# EAGLE design Backplane - Mark Copy (EAGLE 6.5.0)

## Sheet 1 of 4
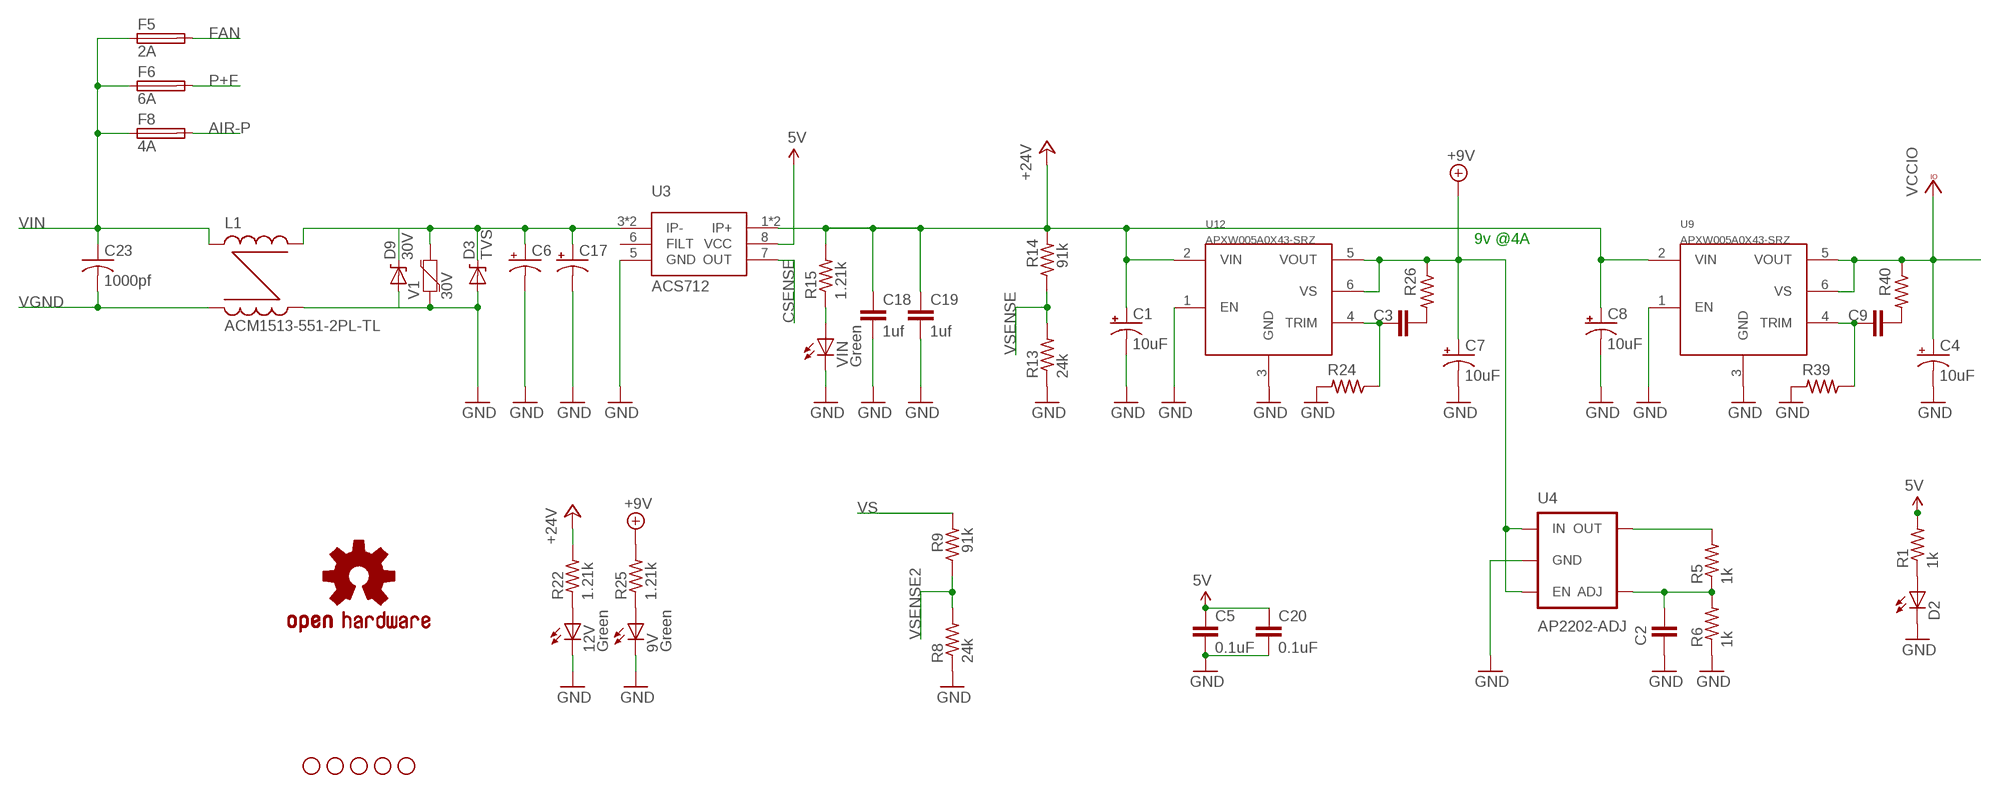
[diagram p0: schematic, sheet 1]

### Parts
9V  Green  LEDCHIP-LED0805  [CHIP-LED0805]
12V  Green  LEDCHIP-LED0805  [CHIP-LED0805]
C1  10uF  CAP_POL3528  [EIA3528]
C2  CAP0805  [0805]
C3  CAP0805  [0805]
C4  10uF  CAP_POL3528  [EIA3528]
C5  0.1uF  CAP0805  [0805]
C6  CPOL-USG  [PANASONIC_G]
C7  10uF  CAP_POL3528  [EIA3528]
C8  10uF  CAP_POL3528  [EIA3528]
C9  CAP0805  [0805]
C17  CPOL-USG  [PANASONIC_G]
C18  1uf  CAP1206  [1206]
C19  1uf  CAP1206  [1206]
C20  0.1uF  CAP0805  [0805]
C23  1000pf  C-USC1825  [C1825]
D2  LEDCHIP-LED0805  [CHIP-LED0805]
D3  TVS  [DO-214AC]
D9  30V  DIODE-ZENERSMB  [SMB-DIODE]
F5  2A  FUSEF456  [F456]
F6  6A  FUSEF456  [F456]
F8  4A  FUSEF456  [F456]
L1  ACM1513-551-2PL-TL  [ACM1513-551-2PL-TL]
R1  1k  R-US_R0805  [R0805]
R5  1k  R-US_R0805  [R0805]
R6  1k  R-US_R0805  [R0805]
R8  24k  R-US_R0805  [R0805]
R9  91k  R-US_R0805  [R0805]
R13  24k  R-US_R0805  [R0805]
R14  91k  R-US_R0805  [R0805]
R15  1.21k  R-US_R0805  [R0805]
R22  1.21k  R-US_R0805  [R0805]
R24  R-US_R0805  [R0805]
R25  1.21k  R-US_R0805  [R0805]
R26  R-US_R0805  [R0805]
R39  R-US_R0805  [R0805]
R40  R-US_R0805  [R0805]
STANDOFF1  STAND-OFF  [STAND-OFF]
STANDOFF2  STAND-OFF  [STAND-OFF]
STANDOFF3  STAND-OFF  [STAND-OFF]
STANDOFF4  STAND-OFF  [STAND-OFF]
STANDOFF5  STAND-OFF  [STAND-OFF]
U3  ACS712  [SO-8]
U4  AP2202-ADJ  [SOT23-5]
U9  APXW005A0X43-SRZ  [APXW005A0X43-SRZ]
U12  APXW005A0X43-SRZ  [APXW005A0X43-SRZ]
U$8  OSHW-LOGOM  [OSHW-LOGO-M]
V1  30V  VARISTOR-0603  [0603-RES]
VIN  Green  LEDCHIP-LED0805  [CHIP-LED0805]

### Nets
5V: C5.1 C20.1 R1.2 U3.8(VCC) ; also sheet 3
+9V: C7.A(+) R25.2 R26.1 U4.1(IN) U4.3(EN) U12.5(VOUT) U12.6(VS)
+24V: C1.A(+) C8.A(+) C18.1 C19.1 R14.2 R15.2 R22.2 U3.1(IP+) U3.2(IP+) U9.2(VIN) U12.2(VIN) ; also sheet 2,3,4
AIR-P: F8.2 ; also sheet 2
CSENSE: U3.7(OUT) ; also sheet 3
FAN: F5.2 ; also sheet 2
GND: 9V.C 12V.C C1.C(-) C2.2 C4.C(-) C5.2 C6.- C7.C(-) C8.C(-) C17.- C18.2 C19.2 C20.2 D2.C D3.A D9.A L1.OUT- R6.1 R8.1 R13.1 R24.2 R39.2 U3.5(GND) U4.2(GND) U9.1(EN) U9.3(GND) U12.1(EN) U12.3(GND) V1.1 VIN.C ; also sheet 2,3,4
N$3: C2.1 R5.1 R6.2 U4.4(ADJ)
N$4: R5.2 U4.5(OUT)
N$8: 9V.A R25.1
N$19: D2.A R1.1
N$29: 12V.A R22.1
N$30: C6.+ C17.+ D3.C D9.C L1.OUT+ U3.3(IP-) U3.4(IP-) V1.2
N$35: C3.1 R26.2
N$37: C3.2 R24.1 U12.4(TRIM)
N$42: R15.1 VIN.A
N$59: C9.1 R40.2
N$60: C9.2 R39.1 U9.4(TRIM)
P+F: F6.2 ; also sheet 2
VCCIO: C4.A(+) R40.1 U9.5(VOUT) U9.6(VS) ; also sheet 3
VGND: C23.2 L1.IN- ; also sheet 2
VIN: C23.1 F5.1 F6.1 F8.1 L1.IN+ ; also sheet 2
VS: R9.2
VSENSE: R13.2 R14.1 ; also sheet 3
VSENSE2: R8.2 R9.1
Unconnected: U3.6(FILT)

### Notes on the sheet
- 9v @4A

## Sheet 2 of 4
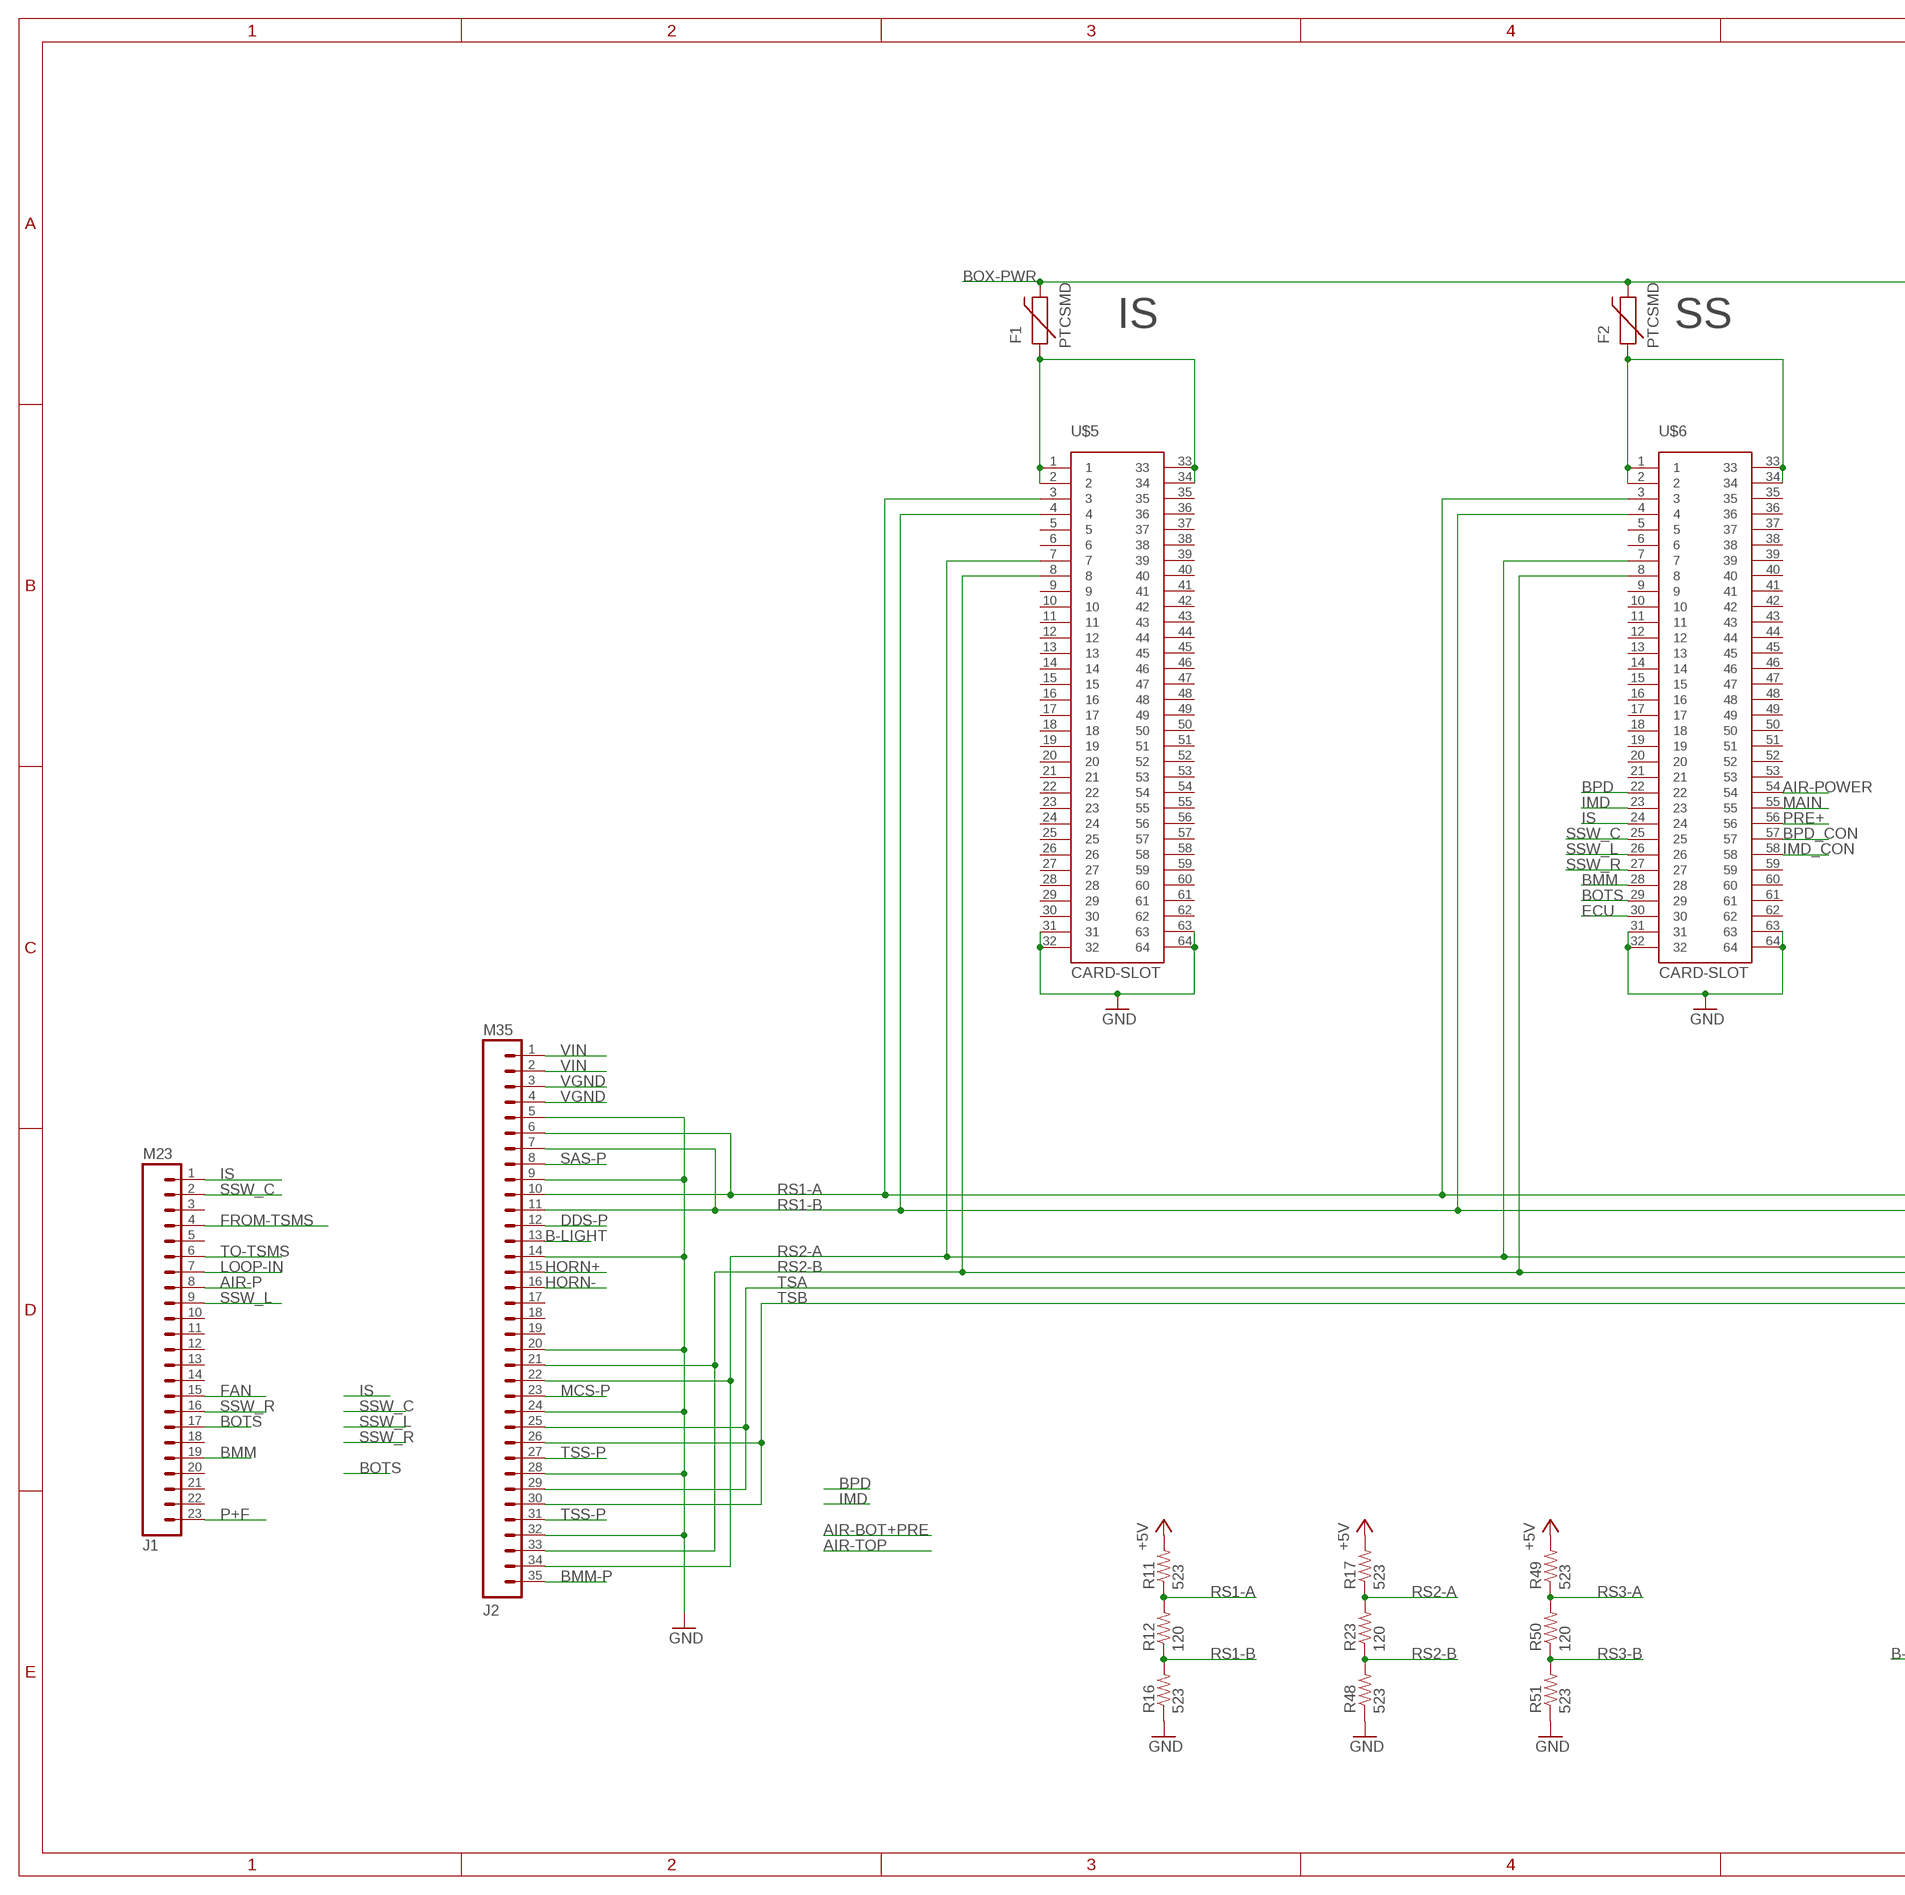
[diagram p1: schematic, sheet 2, part 1 of 2]
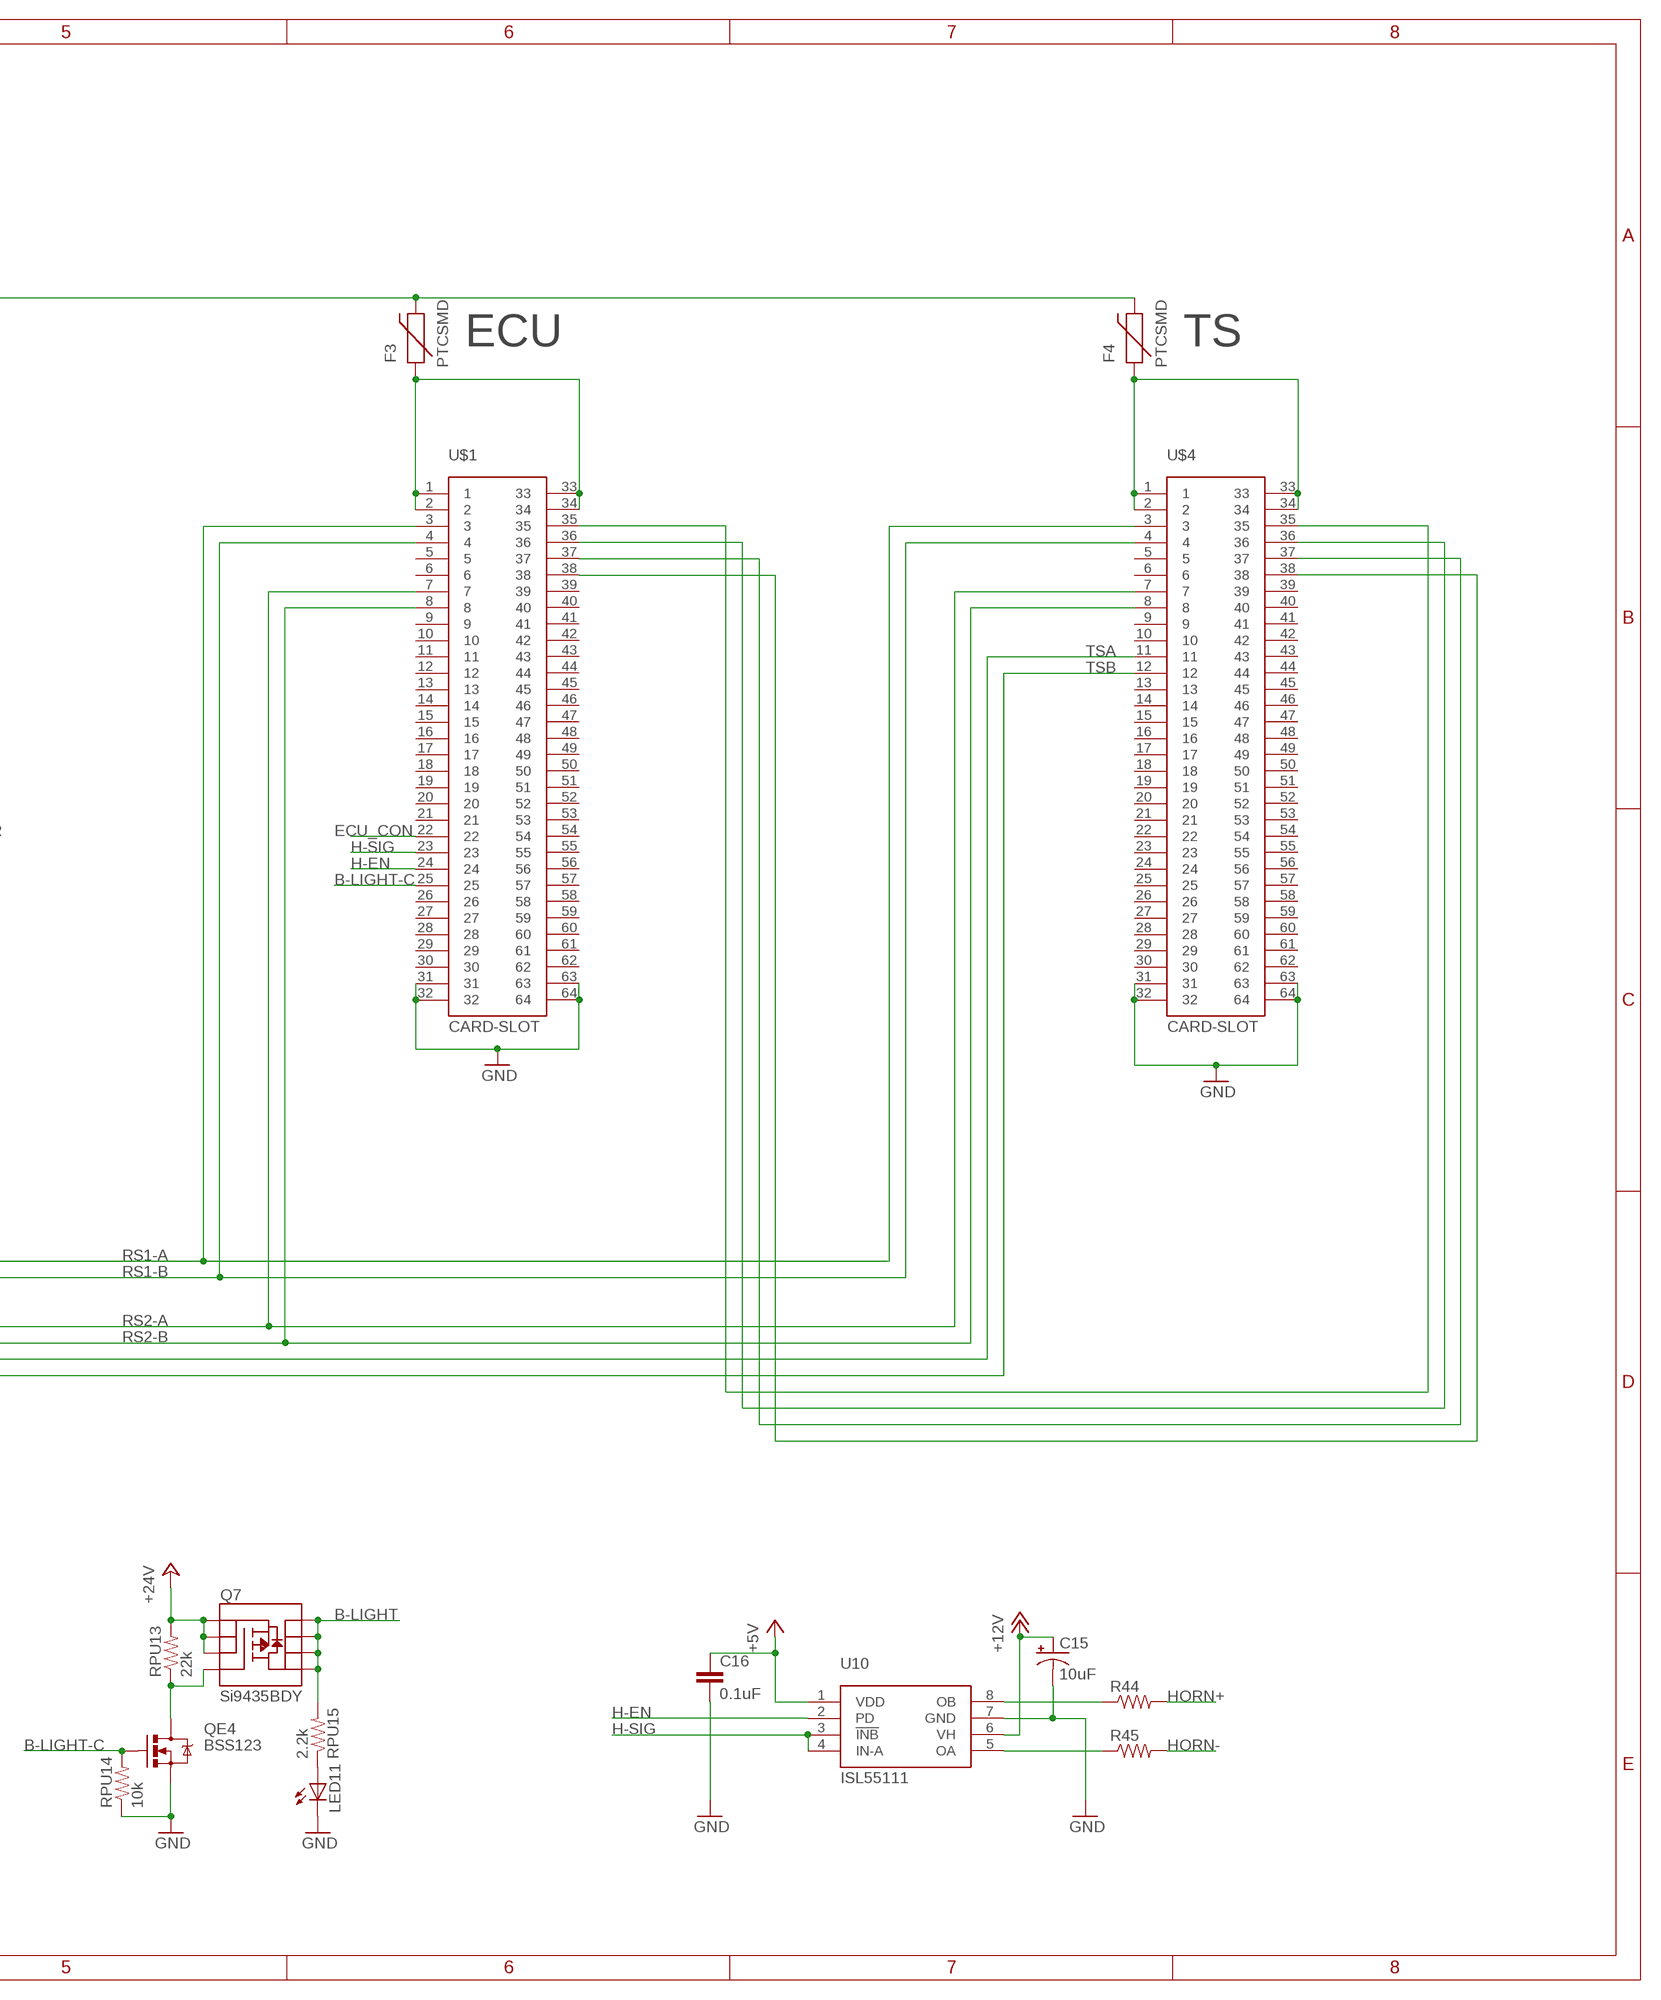
[diagram p2: schematic, sheet 2, part 2 of 2]

### Parts
C15  10uF  CAP_POL3528  [EIA3528]
C16  0.1uF  CAP0805  [0805]
F1  PTCSMD  [PTC-1206]
F2  PTCSMD  [PTC-1206]
F3  PTCSMD  [PTC-1206]
F4  PTCSMD  [PTC-1206]
J1  M23  [1-770669-1]
J2  M35  [1-776163-2]
LED11  LEDCHIP-LED0805  [CHIP-LED0805]
Q7  Si9435BDY  MOSFET-PCHANNEL-SOIC8SOIC8  [SO08]
QE4  BSS123  [SOT-23]
R11  523  RESISTOR0805-RES  [0805]
R12  120  RESISTOR0805-RES  [0805]
R16  523  RESISTOR0805-RES  [0805]
R17  523  RESISTOR0805-RES  [0805]
R23  120  RESISTOR0805-RES  [0805]
R44  RESISTOR0805-RES  [0805]
R45  RESISTOR0805-RES  [0805]
R48  523  RESISTOR0805-RES  [0805]
R49  523  RESISTOR0805-RES  [0805]
R50  120  RESISTOR0805-RES  [0805]
R51  523  RESISTOR0805-RES  [0805]
RPU13  22k  RESISTOR0805-RES  [0805]
RPU14  10k  RESISTOR0805-RES  [0805]
RPU15  2.2k  RESISTOR0805-RES  [0805]
U10  ISL55111  [TSSOP-8]
U$1  CARD-SLOT  [CS64]
U$4  CARD-SLOT  [CS64]
U$5  CARD-SLOT  [CS64]
U$6  CARD-SLOT  [CS64]

### Nets
+5V: C16.1 R11.2 R17.2 R49.2 U10.1(VDD) ; also sheet 3
+12V: C15.A(+) U10.6(VH)
+24V: Q7.1(S) Q7.2(S) Q7.3(S) RPU13.2 ; also sheet 1,3,4
AIR-P: J1.8 ; also sheet 1
AIR-POWER: U$6.54
B-LIGHT: J2.13 Q7.5(D) Q7.6(D) Q7.7(D) Q7.8(D) RPU15.2
B-LIGHT-C: QE4.1(G) RPU14.2 U$1.25
BMM: J1.19 U$6.28
BMM-P: J2.35 ; also sheet 3
BOTS: J1.17 U$6.29
BOX-PWR: F1.2 F2.2 F3.2 F4.2 ; also sheet 3
BPD: U$6.22 ; also sheet 4
BPD_CON: U$6.57
DDS-P: J2.12 ; also sheet 3
ECU: U$6.30 ; also sheet 4
ECU_CON: U$1.22
FAN: J1.15 ; also sheet 1
FROM-TSMS: J1.4 ; also sheet 4
GND: C15.C(-) C16.2 J2.5 J2.9 J2.14 J2.20 J2.24 J2.28 J2.32 LED11.C QE4.2(S) R16.1 R48.1 R51.1 RPU14.1 U10.7(GND) U$1.31 U$1.32 U$1.63 U$1.64 U$4.31 U$4.32 U$4.63 U$4.64 U$5.31 U$5.32 U$5.63 U$5.64 U$6.31 U$6.32 U$6.63 U$6.64 ; also sheet 1,3,4
H-EN: U10.2(PD) U$1.24
H-SIG: U10.3(!INB) U10.4(IN-A) U$1.23
HORN+: J2.15 R44.2
HORN-: J2.16 R45.2
IMD: U$6.23 ; also sheet 4
IMD_CON: U$6.58
IS: J1.1 U$6.24
LOOP-IN: J1.7 ; also sheet 4
MAIN: U$6.55 ; also sheet 4
MCS-P: J2.23 ; also sheet 3
N$5: F1.1 U$5.1 U$5.2 U$5.33 U$5.34
N$9: F2.1 U$6.1 U$6.2 U$6.33 U$6.34
N$12: F3.1 U$1.1 U$1.2 U$1.33 U$1.34
N$13: F4.1 U$4.1 U$4.2 U$4.33 U$4.34
N$32: Q7.4(G) QE4.3(D) RPU13.1
N$34: LED11.A RPU15.1
N$41: U$1.38 U$4.38
N$52: R44.1 U10.8(OB)
N$53: R45.1 U10.5(OA)
N$57: U$1.37 U$4.37
P+F: J1.23 ; also sheet 1
PRE+: U$6.56 ; also sheet 4
RS1-A: J2.6 J2.10 R11.1 R12.2 U$1.3 U$4.3 U$5.3 U$6.3
RS1-B: J2.7 J2.11 R12.1 R16.2 U$1.4 U$4.4 U$5.4 U$6.4
RS2-A: J2.22 J2.34 R17.1 R23.2 U$1.7 U$4.7 U$5.7 U$6.7 ; also sheet 3
RS2-B: J2.21 J2.33 R23.1 R48.2 U$1.8 U$4.8 U$5.8 U$6.8 ; also sheet 3
RS3-A: R49.1 R50.2 U$1.35 U$4.35
RS3-B: R50.1 R51.2 U$1.36 U$4.36
SAS-P: J2.8 ; also sheet 3
SSW_C: J1.2 U$6.25
SSW_L: J1.9 U$6.26
SSW_R: J1.16 U$6.27
TO-TSMS: J1.6 ; also sheet 4
TSA: J2.25 J2.29 U$4.11
TSB: J2.26 J2.30 U$4.12
TSS-P: J2.27 J2.31 ; also sheet 3
VGND: J2.3 J2.4 ; also sheet 1
VIN: J2.1 J2.2 ; also sheet 1
Unconnected: J1.3 J1.5 J1.10 J1.11 J1.12 J1.13 J1.14 J1.18 J1.20 J1.21 J1.22 J2.17 J2.18 J2.19 U$1.5 U$1.6 U$1.9 U$1.10 U$1.11 U$1.12 U$1.13 U$1.14 U$1.15 U$1.16 U$1.17 U$1.18 U$1.19 U$1.20 U$1.21 U$1.26 U$1.27 U$1.28 U$1.29 U$1.30 U$1.39 U$1.40 U$1.41 U$1.42 U$1.43 U$1.44 U$1.45 U$1.46 U$1.47 U$1.48 U$1.49 U$1.50 U$1.51 U$1.52 U$1.53 U$1.54 U$1.55 U$1.56 U$1.57 U$1.58 U$1.59 U$1.60 U$1.61 U$1.62 U$4.5 U$4.6 U$4.9 U$4.10 U$4.13 U$4.14 U$4.15 U$4.16 U$4.17 U$4.18 U$4.19 U$4.20 U$4.21 U$4.22 U$4.23 U$4.24 U$4.25 U$4.26 U$4.27 U$4.28 U$4.29 U$4.30 U$4.39 U$4.40 U$4.41 U$4.42 U$4.43 U$4.44 U$4.45 U$4.46 U$4.47 U$4.48 U$4.49 U$4.50 U$4.51 U$4.52 U$4.53 U$4.54 U$4.55 U$4.56 U$4.57 U$4.58 U$4.59 U$4.60 U$4.61 U$4.62 U$5.5 U$5.6 U$5.9 U$5.10 U$5.11 U$5.12 U$5.13 U$5.14 U$5.15 U$5.16 U$5.17 U$5.18 U$5.19 U$5.20 U$5.21 U$5.22 U$5.23 U$5.24 U$5.25 U$5.26 U$5.27 U$5.28 U$5.29 U$5.30 U$5.35 U$5.36 U$5.37 U$5.38 U$5.39 U$5.40 U$5.41 U$5.42 U$5.43 U$5.44 U$5.45 U$5.46 U$5.47 U$5.48 U$5.49 U$5.50 U$5.51 U$5.52 U$5.53 U$5.54 U$5.55 U$5.56 U$5.57 U$5.58 U$5.59 U$5.60 U$5.61 U$5.62 U$6.5 U$6.6 U$6.9 U$6.10 U$6.11 U$6.12 U$6.13 U$6.14 U$6.15 U$6.16 U$6.17 U$6.18 U$6.19 U$6.20 U$6.21 U$6.35 U$6.36 U$6.37 U$6.38 U$6.39 U$6.40 U$6.41 U$6.42 U$6.43 U$6.44 U$6.45 U$6.46 U$6.47 U$6.48 U$6.49 U$6.50 U$6.51 U$6.52 U$6.53 U$6.59 U$6.60 U$6.61 U$6.62

### Notes on the sheet
- IS | SS | ECU | TS

## Sheet 3 of 4
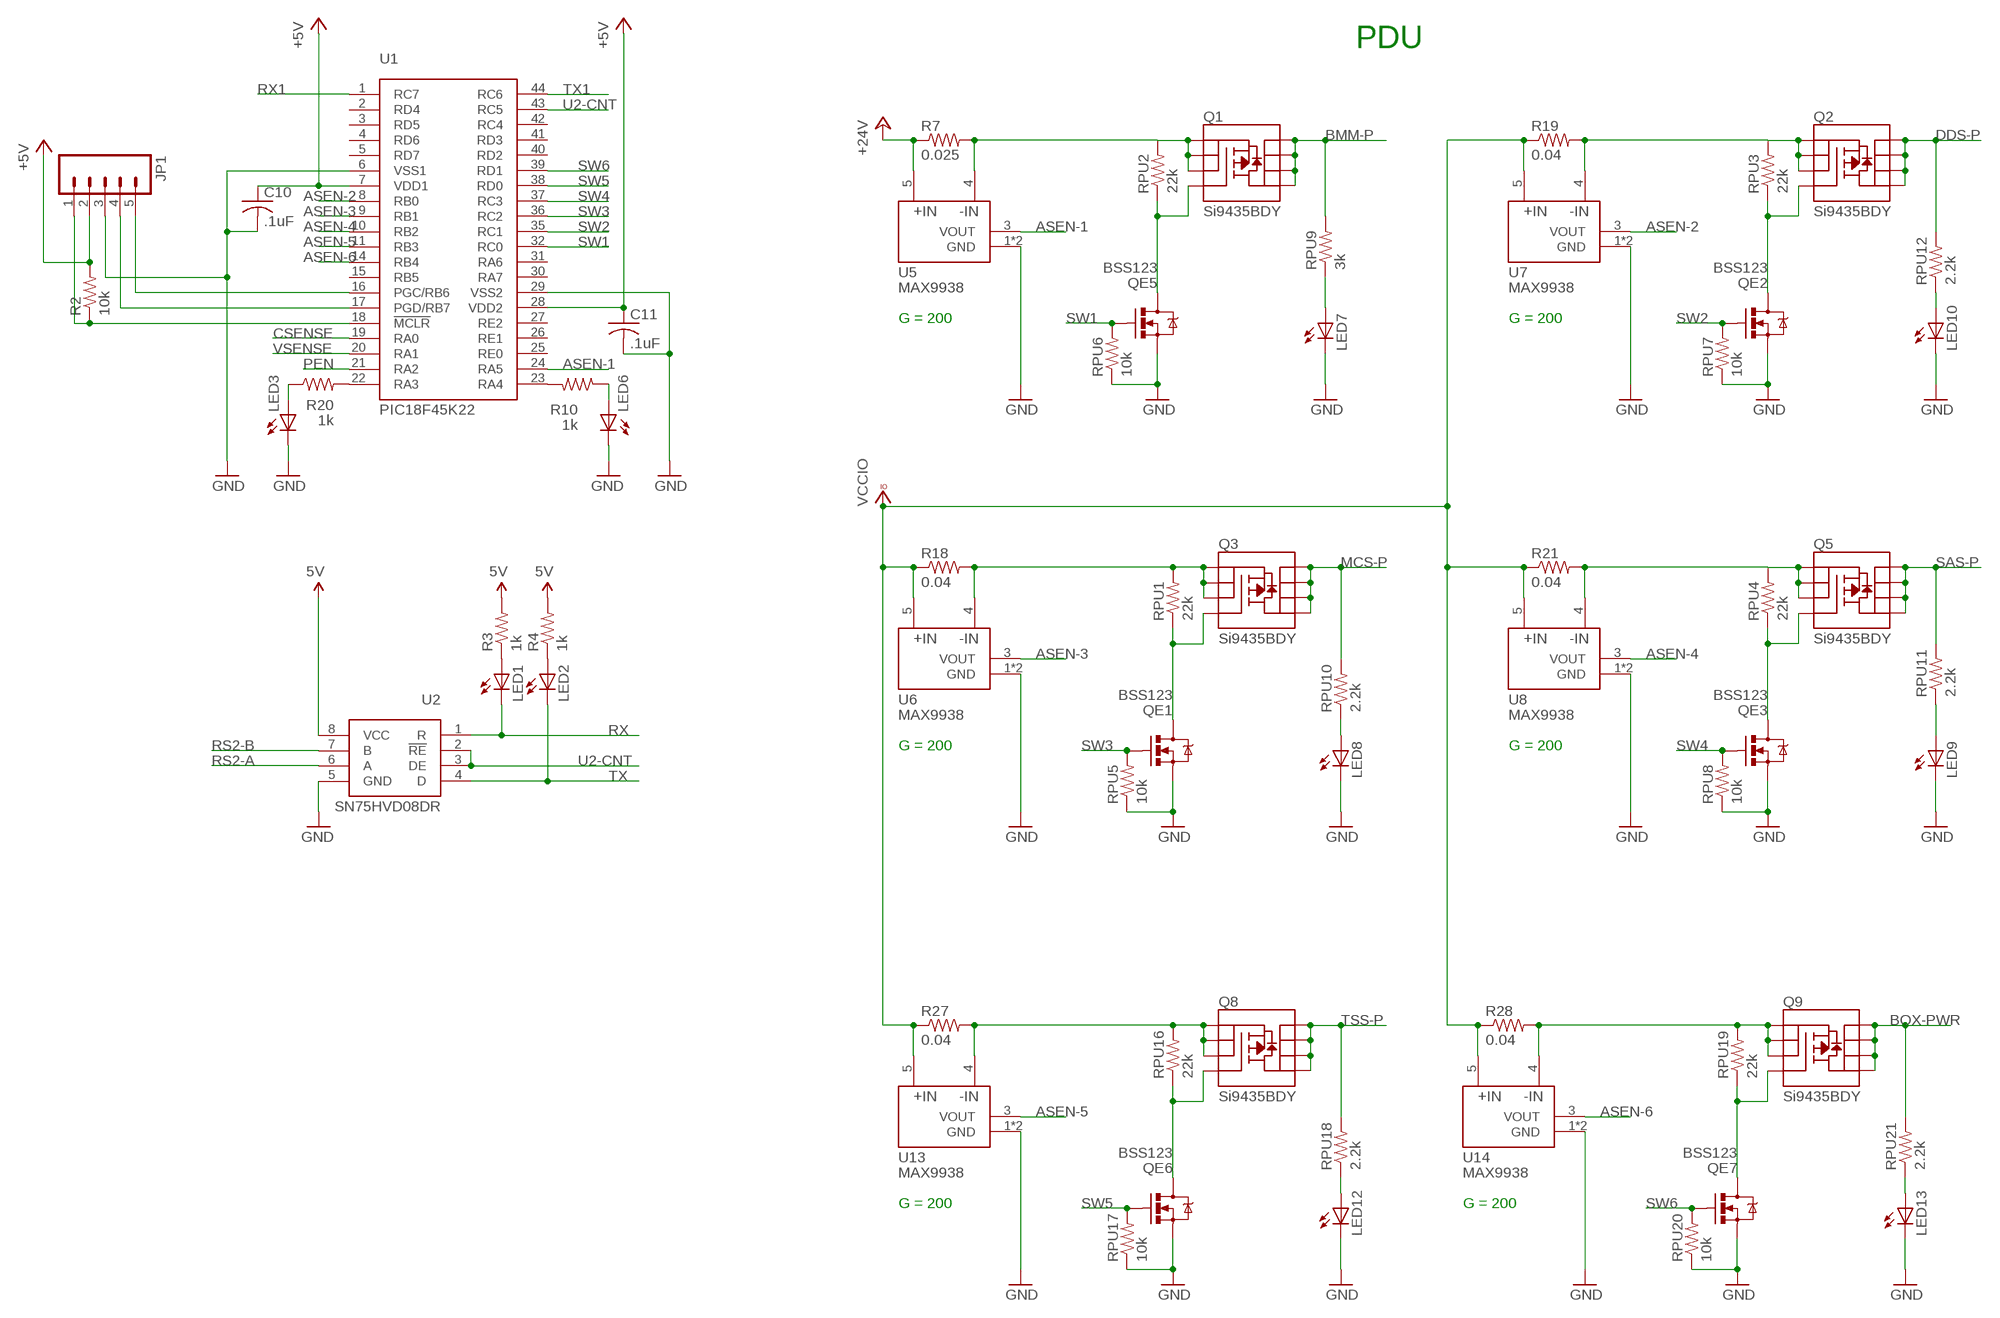
[diagram p3: schematic, sheet 3]

### Parts
C10  .1uF  C-USC0805  [C0805]
C11  .1uF  C-USC0805  [C0805]
JP1  M05LOCK_LONGPADS  [1X05_LOCK_LONGPADS]
LED1  LEDCHIP-LED0805  [CHIP-LED0805]
LED2  LEDCHIP-LED0805  [CHIP-LED0805]
LED3  LEDCHIP-LED0805  [CHIP-LED0805]
LED6  LEDCHIP-LED0805  [CHIP-LED0805]
LED7  LEDCHIP-LED0805  [CHIP-LED0805]
LED8  LEDCHIP-LED0805  [CHIP-LED0805]
LED9  LEDCHIP-LED0805  [CHIP-LED0805]
LED10  LEDCHIP-LED0805  [CHIP-LED0805]
LED12  LEDCHIP-LED0805  [CHIP-LED0805]
LED13  LEDCHIP-LED0805  [CHIP-LED0805]
Q1  Si9435BDY  MOSFET-PCHANNEL-SOIC8SOIC8  [SO08]
Q2  Si9435BDY  MOSFET-PCHANNEL-SOIC8SOIC8  [SO08]
Q3  Si9435BDY  MOSFET-PCHANNEL-SOIC8SOIC8  [SO08]
Q5  Si9435BDY  MOSFET-PCHANNEL-SOIC8SOIC8  [SO08]
Q8  Si9435BDY  MOSFET-PCHANNEL-SOIC8SOIC8  [SO08]
Q9  Si9435BDY  MOSFET-PCHANNEL-SOIC8SOIC8  [SO08]
QE1  BSS123  [SOT-23]
QE2  BSS123  [SOT-23]
QE3  BSS123  [SOT-23]
QE5  BSS123  [SOT-23]
QE6  BSS123  [SOT-23]
QE7  BSS123  [SOT-23]
R2  10k  RESISTOR0805-RES  [0805]
R3  1k  R-US_R0805  [R0805]
R4  1k  R-US_R0805  [R0805]
R7  0.025  R-US_R6332  [R6332]
R10  1k  R-US_R0805  [R0805]
R18  0.04  R-US_R6332  [R6332]
R19  0.04  R-US_R6332  [R6332]
R20  1k  R-US_R0805  [R0805]
R21  0.04  R-US_R6332  [R6332]
R27  0.04  R-US_R6332  [R6332]
R28  0.04  R-US_R6332  [R6332]
RPU1  22k  RESISTOR0805-RES  [0805]
RPU2  22k  RESISTOR0805-RES  [0805]
RPU3  22k  RESISTOR0805-RES  [0805]
RPU4  22k  RESISTOR0805-RES  [0805]
RPU5  10k  RESISTOR0805-RES  [0805]
RPU6  10k  RESISTOR0805-RES  [0805]
RPU7  10k  RESISTOR0805-RES  [0805]
RPU8  10k  RESISTOR0805-RES  [0805]
RPU9  3k  RESISTOR0805-RES  [0805]
RPU10  2.2k  RESISTOR0805-RES  [0805]
RPU11  2.2k  RESISTOR0805-RES  [0805]
RPU12  2.2k  RESISTOR0805-RES  [0805]
RPU16  22k  RESISTOR0805-RES  [0805]
RPU17  10k  RESISTOR0805-RES  [0805]
RPU18  2.2k  RESISTOR0805-RES  [0805]
RPU19  22k  RESISTOR0805-RES  [0805]
RPU20  10k  RESISTOR0805-RES  [0805]
RPU21  2.2k  RESISTOR0805-RES  [0805]
U1  PIC18F45K22  [TQFP-44]
U2  SN75HVD08DR  [SO-8]
U5  MAX9938  [SOT23-5]
U6  MAX9938  [SOT23-5]
U7  MAX9938  [SOT23-5]
U8  MAX9938  [SOT23-5]
U13  MAX9938  [SOT23-5]
U14  MAX9938  [SOT23-5]

### Nets
5V: R3.2 R4.2 U2.8(VCC) ; also sheet 1
+5V: C10.1 C11.1 JP1.2 R2.2 U1.7(VDD1) U1.28(VDD2) ; also sheet 2
+24V: R7.1 U5.5(+IN) ; also sheet 1,2,4
ASEN-1: U1.24(RA5) U5.3(VOUT)
ASEN-2: U1.8(RB0) U7.3(VOUT)
ASEN-3: U1.9(RB1) U6.3(VOUT)
ASEN-4: U1.10(RB2) U8.3(VOUT)
ASEN-5: U1.11(RB3) U13.3(VOUT)
ASEN-6: U1.14(RB4) U14.3(VOUT)
BMM-P: Q1.5(D) Q1.6(D) Q1.7(D) Q1.8(D) RPU9.2 ; also sheet 2
BOX-PWR: Q9.5(D) Q9.6(D) Q9.7(D) Q9.8(D) RPU21.2 ; also sheet 2
CSENSE: U1.19(RA0) ; also sheet 1
DDS-P: Q2.5(D) Q2.6(D) Q2.7(D) Q2.8(D) RPU12.2 ; also sheet 2
GND: C10.2 C11.2 JP1.3 LED3.C LED6.C LED7.C LED8.C LED9.C LED10.C LED12.C LED13.C QE1.2(S) QE2.2(S) QE3.2(S) QE5.2(S) QE6.2(S) QE7.2(S) RPU5.1 RPU6.1 RPU7.1 RPU8.1 RPU17.1 RPU20.1 U1.6(VSS1) U1.29(VSS2) U2.5(GND) U5.1(GND) U5.2(GND) U6.1(GND) U6.2(GND) U7.1(GND) U7.2(GND) U8.1(GND) U8.2(GND) U13.1(GND) U13.2(GND) U14.1(GND) U14.2(GND) ; also sheet 1,2,4
MCS-P: Q3.5(D) Q3.6(D) Q3.7(D) Q3.8(D) RPU10.2 ; also sheet 2
N$1: Q1.4(G) QE5.3(D) RPU2.1
N$2: Q8.1(S) Q8.2(S) Q8.3(S) R27.2 RPU16.2 U13.4(-IN)
N$10: Q3.1(S) Q3.2(S) Q3.3(S) R18.2 RPU1.2 U6.4(-IN)
N$11: Q3.4(G) QE1.3(D) RPU1.1
N$14: Q2.1(S) Q2.2(S) Q2.3(S) R19.2 RPU3.2 U7.4(-IN)
N$16: LED3.A R20.1
N$17: LED7.A RPU9.1
N$18: Q2.4(G) QE2.3(D) RPU3.1
N$20: R20.2 U1.22(RA3)
N$21: LED8.A RPU10.1
N$22: LED9.A RPU11.1
N$24: LED1.A R3.1
N$25: LED2.A R4.1
N$26: Q5.1(S) Q5.2(S) Q5.3(S) R21.2 RPU4.2 U8.4(-IN)
N$27: Q5.4(G) QE3.3(D) RPU4.1
N$28: LED10.A RPU12.1
N$31: Q8.4(G) QE6.3(D) RPU16.1
N$33: Q1.1(S) Q1.2(S) Q1.3(S) R7.2 RPU2.2 U5.4(-IN)
N$36: LED12.A RPU18.1
N$38: Q9.1(S) Q9.2(S) Q9.3(S) R28.2 RPU19.2 U14.4(-IN)
N$39: Q9.4(G) QE7.3(D) RPU19.1
N$40: JP1.4 U1.17(PGD/RB7)
N$43: JP1.5 U1.16(PGC/RB6)
N$44: LED13.A RPU21.1
N$46: JP1.1 R2.1 U1.18(!MCLR)
N$54: LED6.A R10.1
N$56: R10.2 U1.23(RA4)
PEN: U1.21(RA2)
RS2-A: U2.6(A) ; also sheet 2
RS2-B: U2.7(B) ; also sheet 2
RX: LED1.C U2.1(R)
RX1: U1.1(RC7)
SAS-P: Q5.5(D) Q5.6(D) Q5.7(D) Q5.8(D) RPU11.2 ; also sheet 2
SW1: QE5.1(G) RPU6.2 U1.32(RC0)
SW2: QE2.1(G) RPU7.2 U1.35(RC1)
SW3: QE1.1(G) RPU5.2 U1.36(RC2)
SW4: QE3.1(G) RPU8.2 U1.37(RC3)
SW5: QE6.1(G) RPU17.2 U1.38(RD0)
SW6: QE7.1(G) RPU20.2 U1.39(RD1)
TSS-P: Q8.5(D) Q8.6(D) Q8.7(D) Q8.8(D) RPU18.2 ; also sheet 2
TX: LED2.C U2.4(D)
TX1: U1.44(RC6)
U2-CNT: U1.43(RC5) U2.2(!RE) U2.3(DE)
VCCIO: R18.1 R19.1 R21.1 R27.1 R28.1 U6.5(+IN) U7.5(+IN) U8.5(+IN) U13.5(+IN) U14.5(+IN) ; also sheet 1
VSENSE: U1.20(RA1) ; also sheet 1
Unconnected: U1.2(RD4) U1.3(RD5) U1.4(RD6) U1.5(RD7) U1.15(RB5) U1.25(RE0) U1.26(RE1) U1.27(RE2) U1.30(RA7) U1.31(RA6) U1.40(RD2) U1.41(RD3) U1.42(RC4)

### Notes on the sheet
- PDU
- G = 200 | G = 200
- G = 200 | G = 200
- G = 200 | G = 200

## Sheet 4 of 4
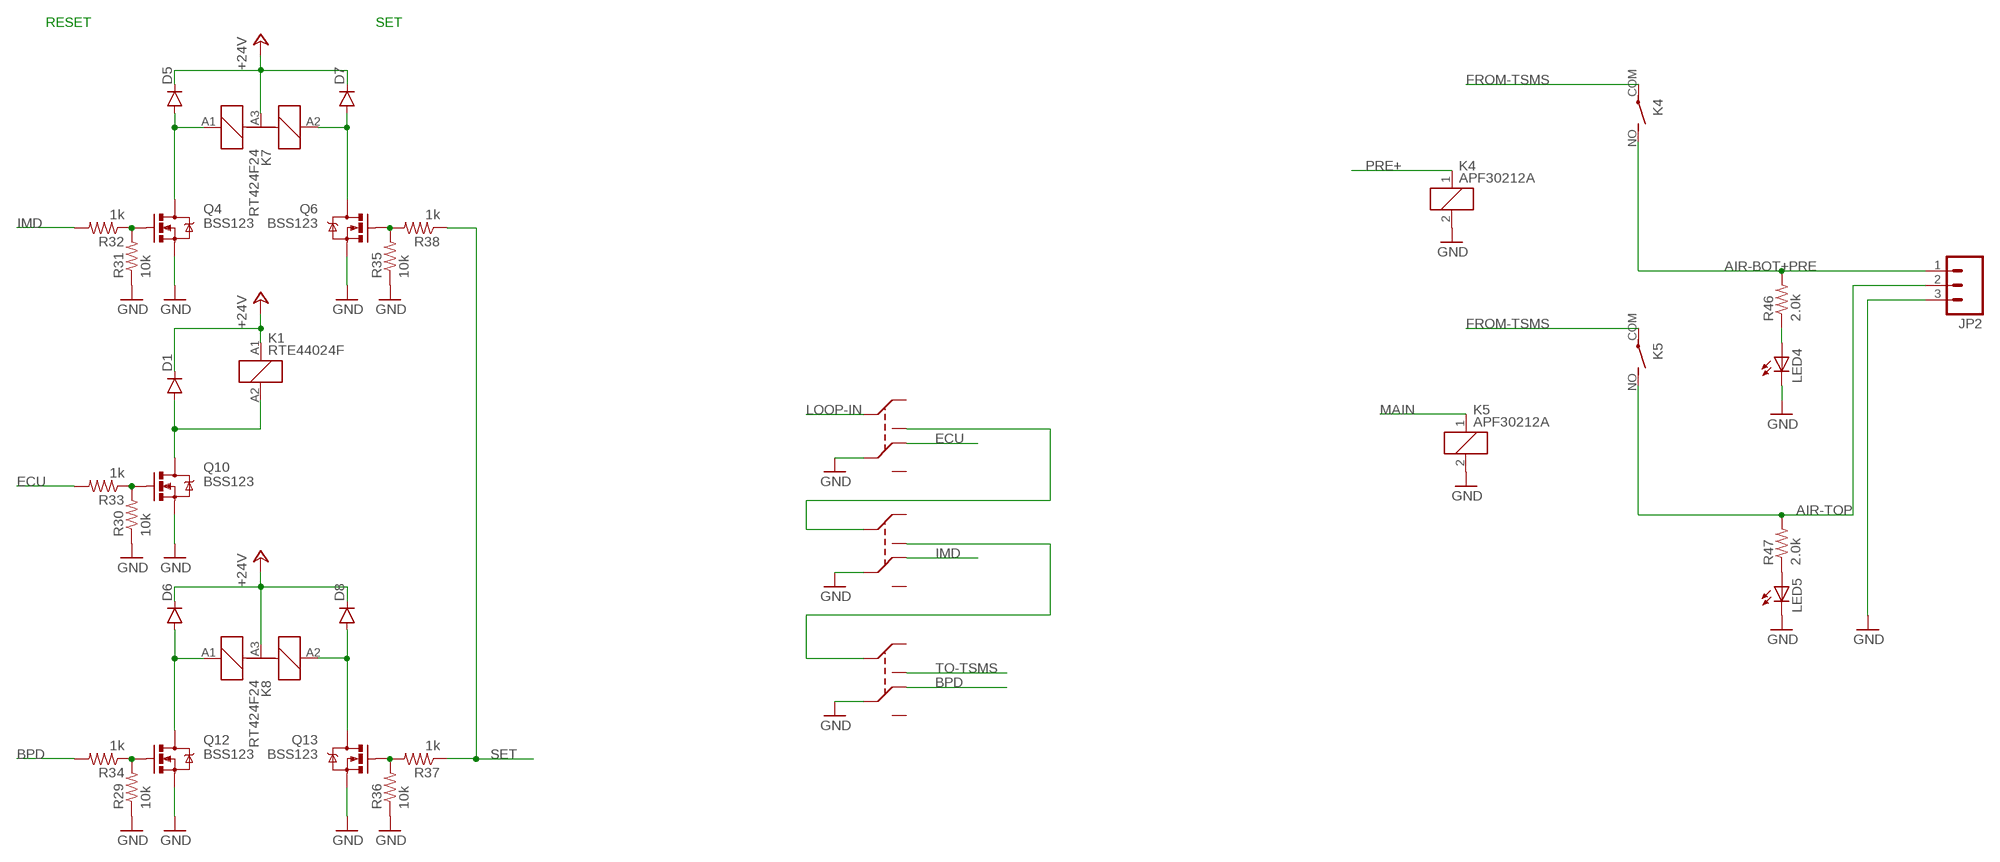
[diagram p4: schematic, sheet 4]

### Parts
D1  DIODESMA-KIT  [SMA-DIODE-KIT]
D5  DIODESMA-KIT  [SMA-DIODE-KIT]
D6  DIODESMA-KIT  [SMA-DIODE-KIT]
D7  DIODESMA-KIT  [SMA-DIODE-KIT]
D8  DIODESMA-KIT  [SMA-DIODE-KIT]
JP2  M03POLAR_LOCK  [MOLEX-1X3_LOCK]
K1  RTE44024F  [RTE44024F]
K4  APF30212A  [APF30212A]
K5  APF30212A  [APF30212A]
K7  RT424F24  [RT424F24]
K8  RT424F24  [RT424F24]
LED4  LEDCHIPLED_0805  [CHIPLED_0805]
LED5  LEDCHIPLED_0805  [CHIPLED_0805]
Q4  BSS123  MOSFET-NCHANNELBSS123LT1G  [SOT23-3]
Q6  BSS123  MOSFET-NCHANNELBSS123LT1G  [SOT23-3]
Q10  BSS123  MOSFET-NCHANNELBSS123LT1G  [SOT23-3]
Q12  BSS123  MOSFET-NCHANNELBSS123LT1G  [SOT23-3]
Q13  BSS123  MOSFET-NCHANNELBSS123LT1G  [SOT23-3]
R29  10k  RESISTOR0805-RES  [0805]
R30  10k  RESISTOR0805-RES  [0805]
R31  10k  RESISTOR0805-RES  [0805]
R32  1k  RESISTOR0805-RES  [0805]
R33  1k  RESISTOR0805-RES  [0805]
R34  1k  RESISTOR0805-RES  [0805]
R35  10k  RESISTOR0805-RES  [0805]
R36  10k  RESISTOR0805-RES  [0805]
R37  1k  RESISTOR0805-RES  [0805]
R38  1k  RESISTOR0805-RES  [0805]
R46  2.0k  RESISTOR0805-RES  [0805]
R47  2.0k  RESISTOR0805-RES  [0805]

### Nets
+24V: D1.C D5.C D6.C D7.C D8.C K1.A1(+) K7.A3(-) K8.A3(-) ; also sheet 1,2,3
AIR-BOT+PRE: JP2.1 K4.NO(2:S) R46.2 ; also sheet 2
AIR-TOP: JP2.2 K5.NO(2:S) R47.2 ; also sheet 2
BPD: R34.2 ; also sheet 2
ECU: K1.22(NC2) R33.2 ; also sheet 2
FROM-TSMS: K4.COM(2:P) K5.COM(2:P) ; also sheet 2
GND: JP2.3 K1.21(C2) K4.2 K5.2 K7.21(C2) K8.21(C2) LED4.C LED5.C Q4.2(S) Q6.2(S) Q10.2(S) Q12.2(S) Q13.2(S) R29.1 R30.1 R31.1 R35.1 R36.1 ; also sheet 1,2,3
IMD: K7.22(NC2) R32.2 ; also sheet 2
LOOP-IN: K1.11(C1) ; also sheet 2
MAIN: K5.1 ; also sheet 2
N$6: Q4.1(G) R31.2 R32.1
N$7: K1.14(NO1) K7.11(C1)
N$15: K7.14(NO1) K8.11(C1)
N$23: Q6.1(G) R35.2 R38.2
N$45: D1.A K1.A2(-) Q10.3(D)
N$47: D5.A K7.A1(+1) Q4.3(D)
N$48: Q10.1(G) R30.2 R33.1
N$49: D7.A K7.A2(+2) Q6.3(D)
N$50: D6.A K8.A1(+1) Q12.3(D)
N$51: D8.A K8.A2(+2) Q13.3(D)
N$55: Q13.1(G) R36.2 R37.2
N$58: Q12.1(G) R29.2 R34.1
N$71: LED4.A R46.1
N$72: LED5.A R47.1
PRE+: K4.1 ; also sheet 2
SET: R37.1 R38.1
TO-TSMS: K8.14(NO1) ; also sheet 2
Unconnected: K1.12(NC1) K1.24(NO2) K7.12(NC1) K7.24(NO2) K8.12(NC1) K8.22(NC2) K8.24(NO2)

### Notes on the sheet
- RESET | SET

## Library data of the parts
9V 12V D2 LED1-LED13 VIN = adafruit:LED: LED OSRAM: - CHIPLED LG R971, LG N971, LY N971, LG Q971, LY Q971, LO R971, LY R971 LH N974, LH R974 LS Q976, LO Q976, LY Q976 LO Q996 - Hyper CHIPLED LW Q18S LB Q993, LB Q99A, LB R99A - SideLED LS A670, LO A670, LY A670, LG A670, LP A670 LB A673, LV A673, LT A673, LW A673 LH A674 LY A675 LS A676, LA A676, LO A676, LY A676, LW A676 LS A679, LY A679, LG A679 - Hyper Micro SIDELED® LS Y876, LA Y876, LO Y876, LY Y876 LT Y87S - SmartLED LW L88C, LW L88S LB L89C, LB L89S, LG L890 LS L89K, LO L89K, LY L89K LS L896, LA L896, LO L896, LY L896 - TOPLED LS T670, LO T670, LY T670, LG T670, LP T670 LSG T670, LSP T670, LSY T670, LOP T670, LYG T670 LG T671, LOG T671, LSG T671 LB T673, LV T673, LT T673, LW T673 LH T674 LS T676, LA T676, LO T676, LY T676, LB T676, LH T676, LSB T676, LW T676 LB T67C, LV T67C, LT T67C, LS T67K, LO T67K, LY T67K, LW E67C LS E67B, LA E67B, LO E67B, LY E67B, LB E67C, LV E67C, LT E67C LW T67C LS T679, LY T679, LG T679 LS T770, LO T770, LY T770, LG T770, LP T770 LB T773, LV T773, LT T773, LW T773 LH T774 LS E675, LA E675, LY E675, LS T675 LS T776, LA T776, LO T776, LY T776, LB T776 LHGB T686 LT T68C, LB T68C - Hyper Mini TOPLED® LB M676 - Mini TOPLED Santana® LG M470 LS M47K, LO M47K, LY M47K Source: http://www.osram.convergy.de/
C1 C4 C7 C8 C15 = SparkFun-Passives:CAP_POL: Capacitor Polarized These are standard SMD and PTH capacitors. Normally 10uF, 47uF, and 100uF in electrolytic and tantalum varieties. Always verify the external diameter of the through hole cap, it varies with capacity, voltage, and manufacturer. The EIA devices should be standard.
C2 C3 C9 = SparkFun-Capacitors:CAP: Capacitor Standard 0603 ceramic capacitor, and 0.1" leaded capacitor.
C5 C16 C18-C20 = SparkFun-Passives:CAP: Capacitor Standard 0603 ceramic capacitor, and 0.1" leaded capacitor.
C6 C17 = adafruit:CPOL-US: POLARIZED CAPACITOR, American symbol
C10 C11 C23 = adafruit:C-US: CAPACITOR, American symbol
D1 D5-D8 = SparkFun-DiscreteSemi:DIODE: Diode These are standard reverse protection diodes and small signal diodes. SMA package can handle up to about 1A. SOD-323 can handle about 200mA. What the SOD-323 package when ordering, there are some mfgs out there that are 5-pin packages.
D3 = NASA_LIB:TVS
D9 = SparkFun:DIODE-ZENER: Zener Diode Production Part - 8199 3.4V Zener Voltage
F1-F4 = SparkFun-PowerIC:PTC: Resettable Fuse PTC Resettable Fuse. Spark Fun Electronics SKU : COM-08357; PROD_ID: RES-11150
F5 F6 F8 = fuse:FUSE: Fuse; OC_FARNELL: unknown; OC_NEWARK: unknown
J1 = FSAE Eletric:M23
J2 = FSAE Eletric:M35
JP1 = SparkFun-Connectors:M05: Header 5 Standard 5-pin 0.1" header. Use with straight break away headers (SKU : PRT-00116), right angle break away headers (PRT-00553), swiss pins (PRT-00743), machine pins (PRT-00117), and female headers (PRT-00115). Molex polarized connector foot print use with SKU : PRT-08230 with associated crimp pins and housings.
JP2 = SparkFun-Connectors:M03: Header 3 Standard 3-pin 0.1" header. Use with straight break away headers (SKU : PRT-00116), right angle break away headers (PRT-00553), swiss pins (PRT-00743), machine pins (PRT-00117), and female headers (PRT-00115). Molex polarized connector foot print use with SKU : PRT-08232 with associated crimp pins and housings.
K1 = FSAE Eletric:RTE44024F
K4 K5 = relay:APF30212A: Compliant with European standards 1a/1c 6A Slim power relays Source: Data sheet <http://pewa.panasonic.com/assets/pcsd/catalog/pf-catalog.pdf>; OC_FARNELL: unknown
K7 K8 = FSAE Eletric:RT424F24
L1 = FSAE Eletric:ACM1513-551-2PL-TL
Q1-Q3 Q5 Q7-Q9 = SparkFun-DiscreteSemi:MOSFET-PCHANNEL-SOIC8: Generic 8-pin PMOSFET
Q4 Q6 Q10 Q12 Q13 = SparkFun-DiscreteSemi:MOSFET-NCHANNEL: Common NMOSFET Parts MFG P/N Store ID Prod ID FDD8780 TRANS-09984 SI7820DN TRANS-11055 FDS6630A IC-08089 2N7002PW TRANS-11151 FQP30N06L COM-10213 TRANS-10060 BSS123LT1G TRANS-08345 BSS138 TRANS-00830 BS170 2N7000; PROD_ID: TRANS-08345
QE1-QE7 = DFT:BSS123
R1 R3-R10 R13-R15 R18-R22 R24-R28 R39 R40 = adafruit:R-US_: RESISTOR, American symbol
R2 R11 R12 R16 R17 R23 R29-R38 R44-R51 = SparkFun-Passives:RESISTOR: Resistor Basic schematic elements and footprints for 0603, 1206, and PTH resistors.
RPU1-RPU21 = SparkFun:RESISTOR: Resistor Basic schematic elements and footprints for 0603, 1206, and PTH resistors.
STANDOFF1-STANDOFF5 = SparkFun-Electromechanical:STAND-OFF: #4 Stand Off This is the mechanical footprint for a #4 phillips button head screw. Use the keepout ring to avoid running the screw head into surrounding components. SKU : PRT-00447
U1 = FSAE Eletric:PIC18F45K22
U2 = FSAE Eletric:SN75HVD08DR
U3 = FSAE Eletric:ACS712
U4 = SparkFun-PowerIC:AP2202-ADJ: AP2202 Adjustable LDO Diodes Inc small, low-cost LDO 150mA, 13.2V, less than 200mV dropout; PROD_ID: VREG-12189
U5-U8 U13 U14 = FSAE Eletric:MAX9938
U9 U12 = NASA_LIB:APXW005A0X43-SRZ
U10 = FSAE Eletric:ISL55111
U$1 U$4-U$6 = FSAE Eletric:CARD-SLOT
U$8 = SparkFun:OSHW-LOGO: Open Source Hardware Logo This logo indicates the piece of hardware it is found on incorporates a OSHW license and/or adheres to the definition of open source hardware found here: http://freedomdefined.org/OSHW
V1 = SparkFun:VARISTOR: Varistor Varistor (Variable resistor) is a nonlinear resistive element of the voltage dependence that resistance changes with applied voltage. Varistor is equivalent with Zener diode of two series connection.

## Net classes
0 default: clearance 0.355 mm
1 power: width 0.61 mm, drill 0.711 mm, clearance 0.203 mm

## Board
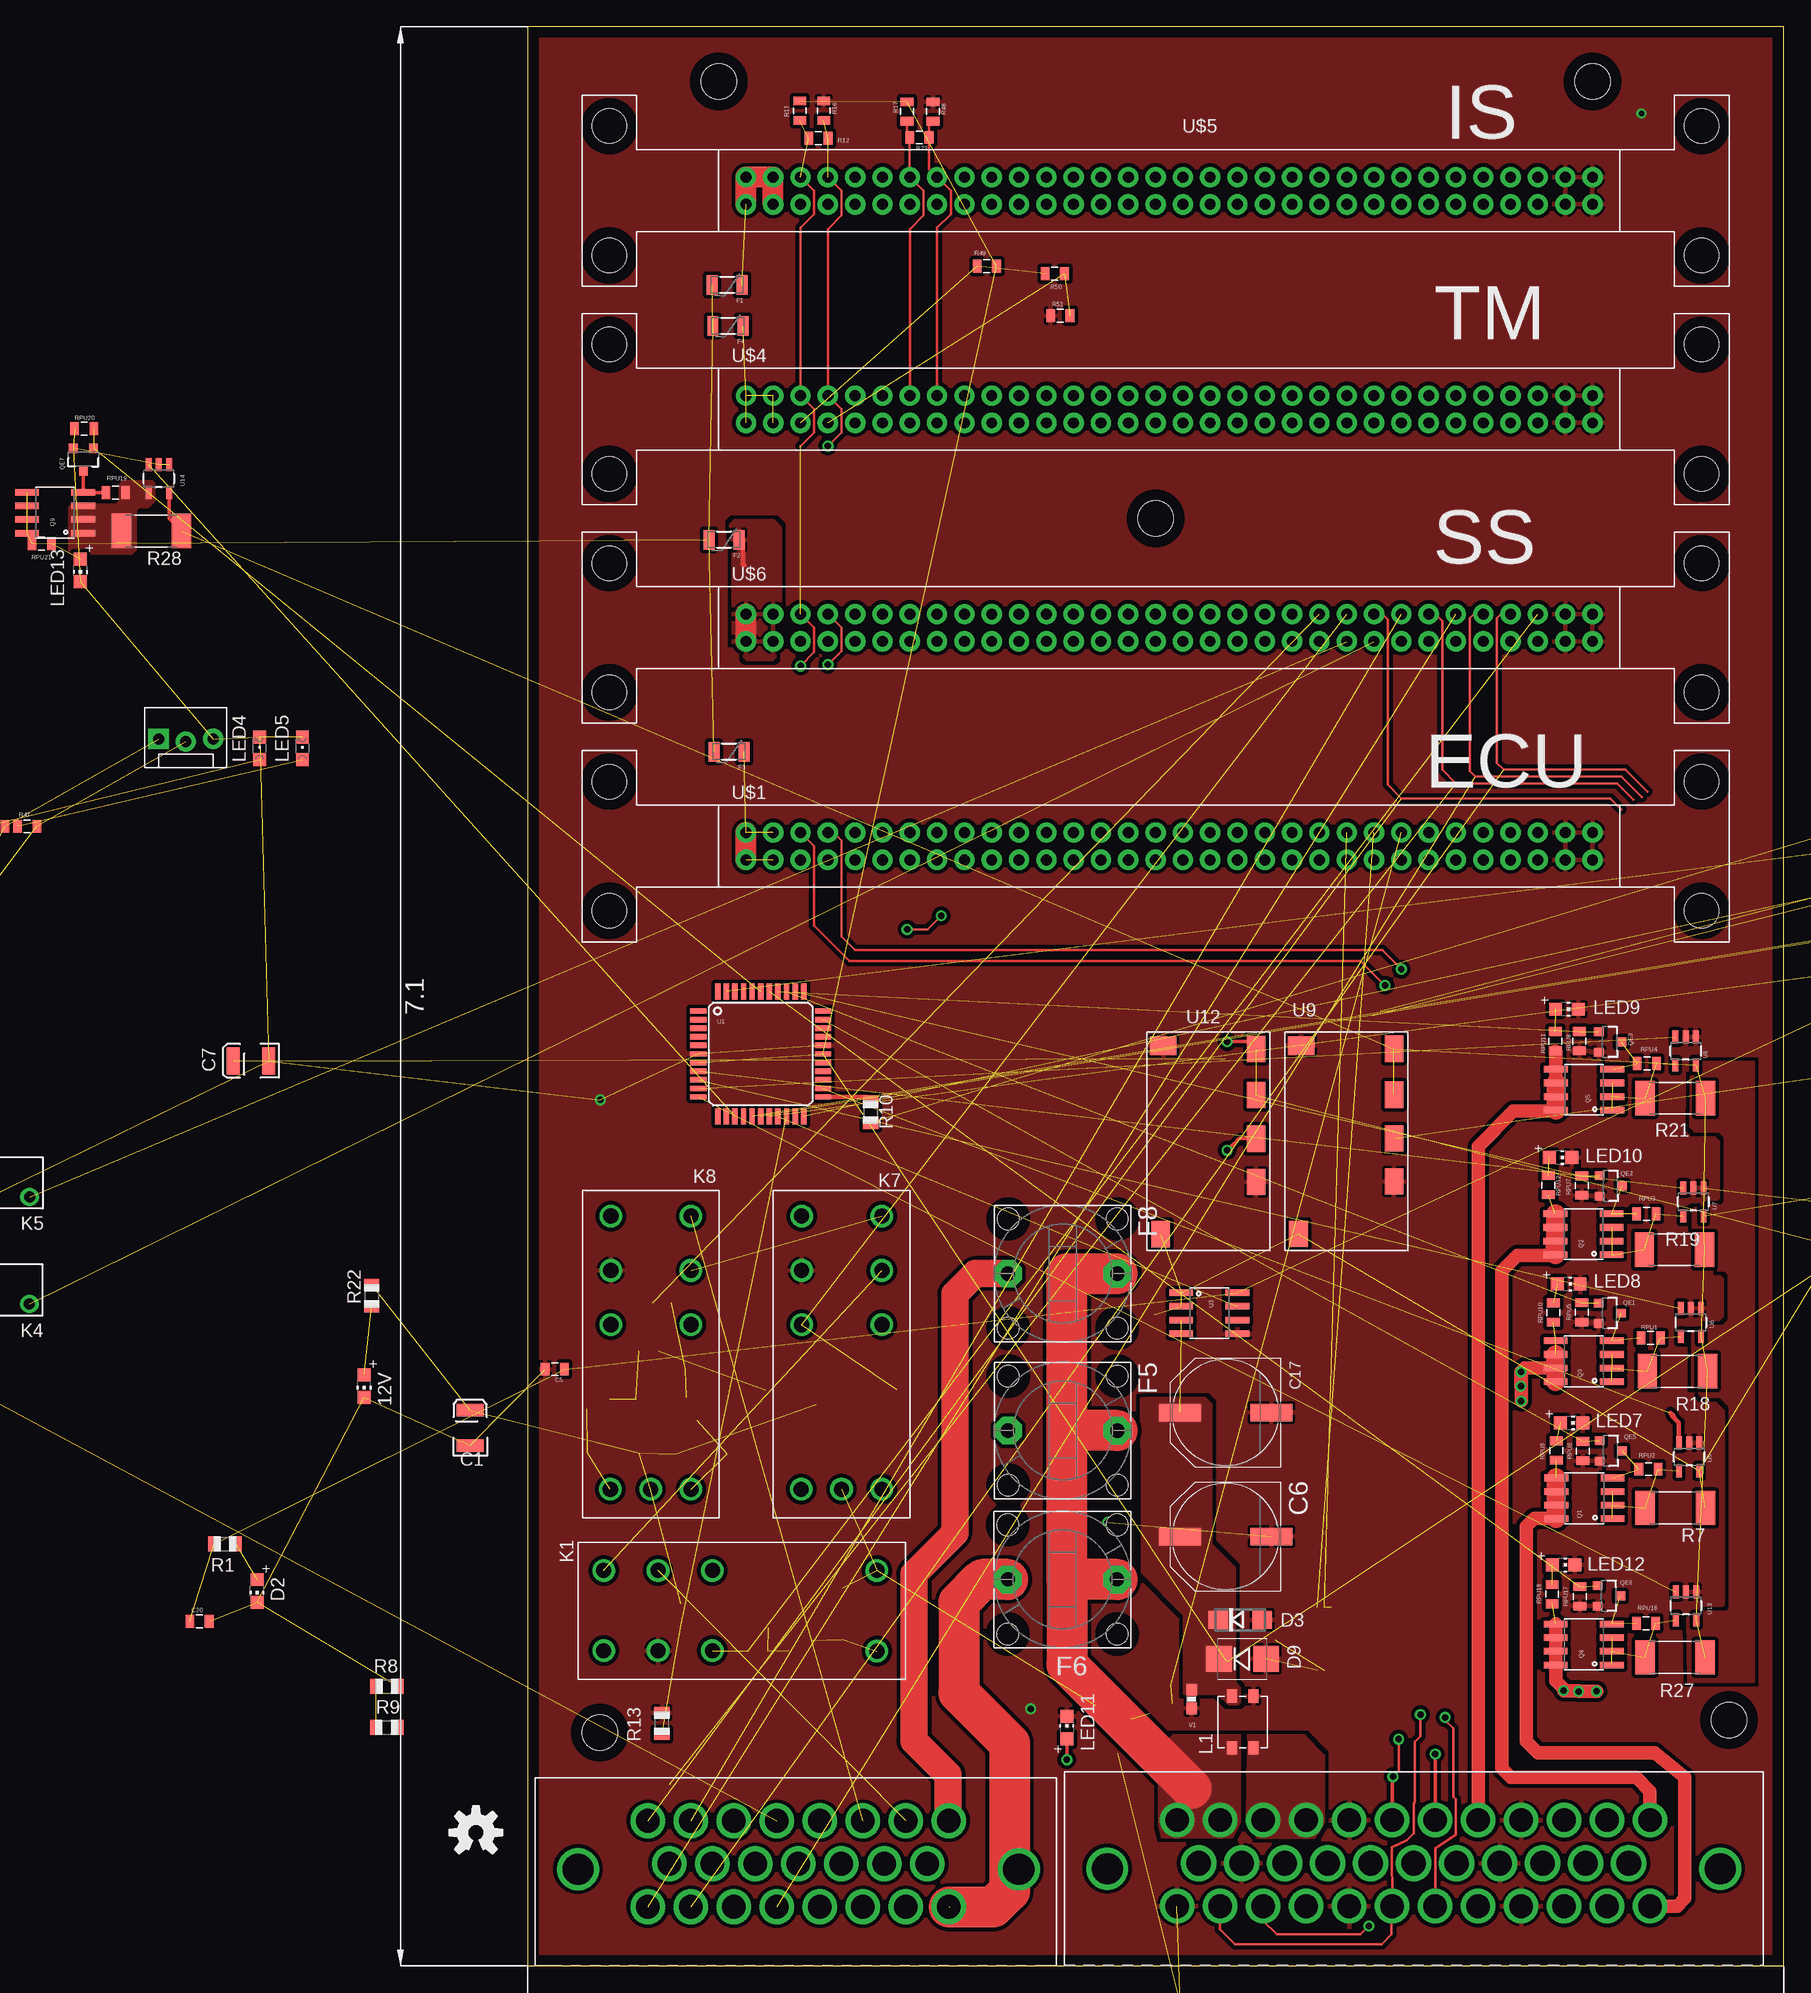
[diagram p5: board, top side]
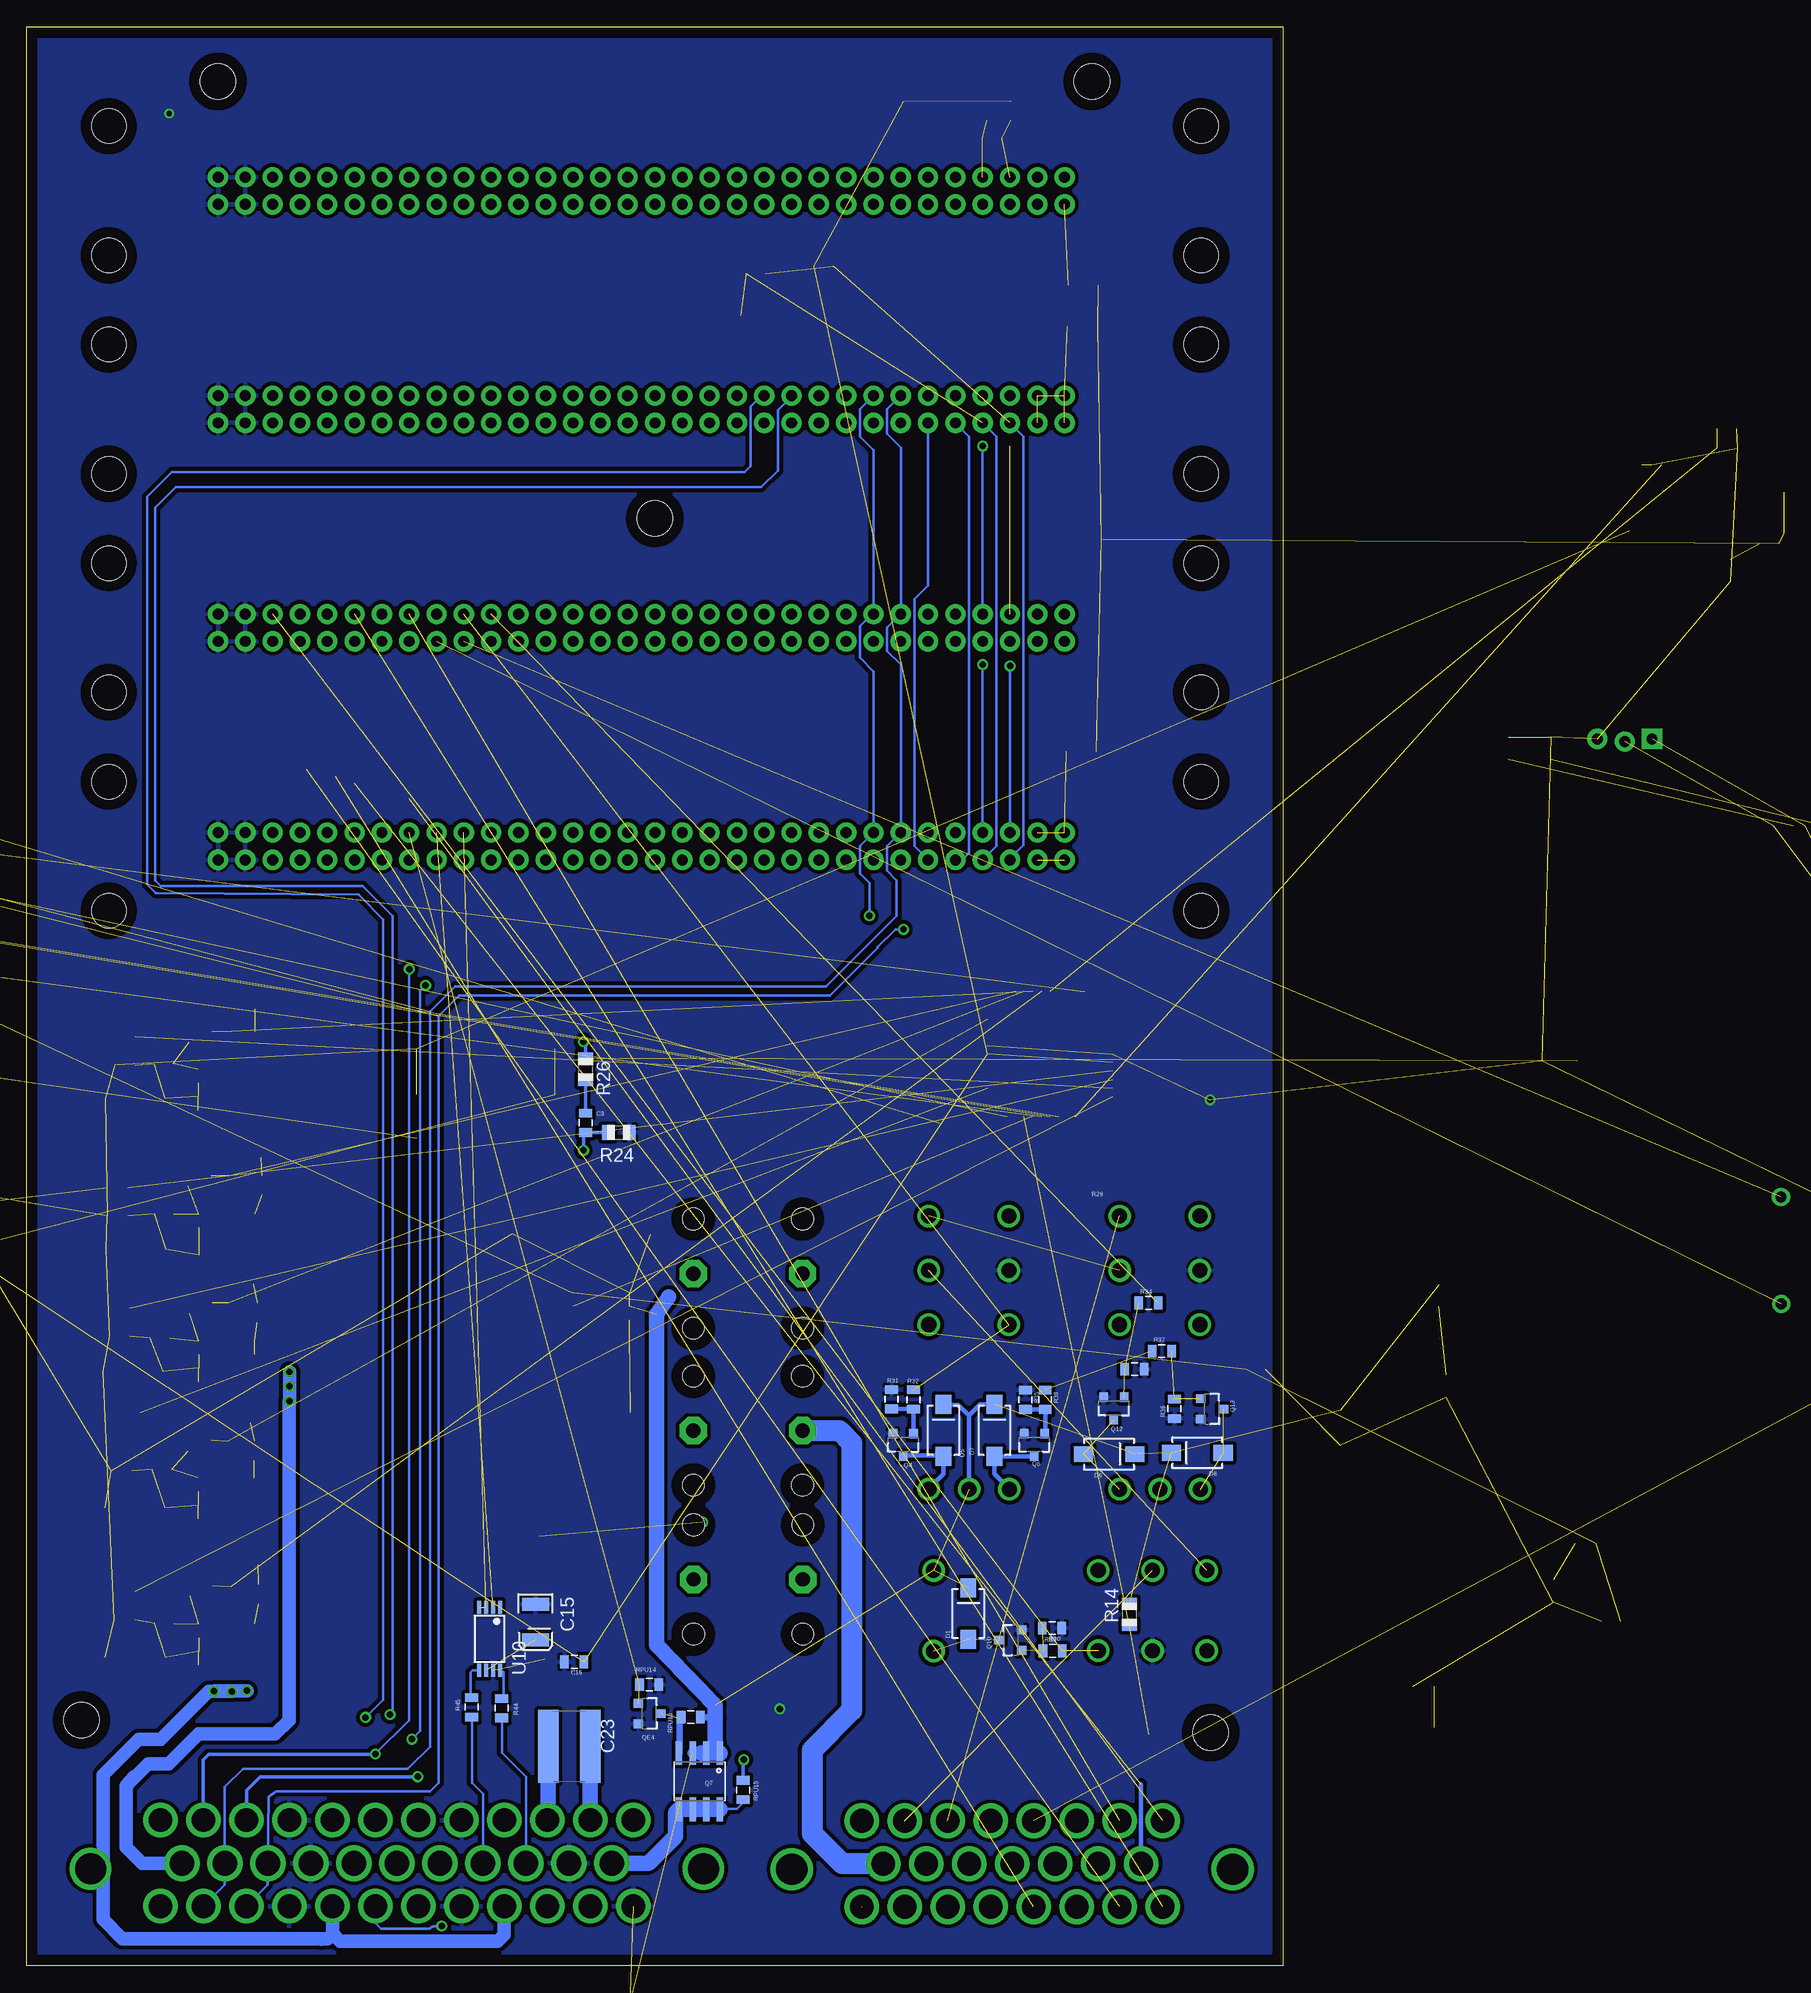
[diagram p6: board, bottom side, seen from below]

Size 116.84 x 180.34 mm. Coordinates in mm from the lower left corner, seen from the top.
Outline: 0,0 116.84,0 116.84,180.34 0,180.34 0,0
Copper layers (1*16): Top 0.035mm / dielectric 1.5mm / Bottom 0.035mm
Design rules "default": minimum track width 10mil, minimum drill 24mil, track to track 8mil, track to pad 8mil, pad to pad 8mil, via to via 8mil, smd to smd 8mil, copper to edge 40mil, drill to drill 8mil, minimum pad ring 10mil, minimum via ring 8mil, stop-mask expansion 4mil, vias tented up to drill 0mil, thermal gap 10mil

### Footprints (pad centres in the part's own frame; a part is rotated, then mirrored left to right if it is on the bottom)
CHIP-LED0805 = smd 1.2 x 1.2: A 0,-1.05; C 0,1.05
EIA3528 = smd 1.2 x 2.5: A 1.65,0; C -1.65,0
0805 = smd 0.8 x 1.2: 1 -0.9,0; 2 0.9,0
PANASONIC_G = smd 3.9 x 1.6: + 4.25,0; - -4.25,0
C0805 = smd 1.3 x 1.5: 1 -0.85,0; 2 0.85,0
1206 = smd 1.6 x 1.8: 1 -1.4,0; 2 1.4,0
C1825 = smd 1.9 x 6.8: 1 -1.95,0; 2 1.95,0
SMA-DIODE-KIT = smd 1.77 x 1.47: A -2.4,0; C 2.4,0
DO-214AC = smd 1.8 x 1.7: A 2.05,0; C -2.05,0
SMB-DIODE = smd 2.4 x 2.4: A 2.2,0; C -2.2,0
PTC-1206 = smd 1 x 1.8: 1 -1.4,0; 2 1.4,0
F456 = drill 1.321 pad 2.54 octagon: 1 0,5.08; 2 0,-5.08 | hole 2.007: 5.08,5.08; 5.08,-5.08; -5.08,-5.08; -5.08,5.08
1-770669-1 = drill 2.2: 1 -14,4; 2 -10,4; 3 -6,4; 4 -2,4; 5 2,4; 6 6,4; 7 10,4; 8 14,4; 9 -12,0; 10 -8,0; 11 -4,0; 12 0,0; 13 4,0; 14 8,0; 15 12,0; 16 -14,-4; 17 -10,-4; 18 -6,-4; 19 -2,-4; 20 2,-4; 21 6,-4; 22 10,-4; 23 14,-4 | drill 2.9: 24 -20.5,-0.5; 25 20.5,-0.5
1-776163-2 = drill 2.2: 1 -22,4; 2 -18,4; 3 -14,4; 4 -10,4; 5 -6,4; 6 -2,4; 7 2,4; 8 6,4; 9 10,4; 10 14,4; 11 18,4; 12 22,4; 24 -22,-4; 25 -18,-4; 26 -14,-4; 27 -10,-4; 28 -6,-4; 29 -2,-4; 30 2,-4; 31 6,-4; 32 10,-4; 33 14,-4; 34 18,-4; 35 22,-4 | drill 2.3: 13 -20,0; 14 -16,0; 15 -12,0; 16 -8,0; 17 -4,0; 18 0,0; 19 4,0; 20 8,0; 21 12,0; 22 16,0; 23 20,0 | drill 2.88: TH1 -28.5,-0.5; TH2 28.5,-0.5
1X05_LOCK_LONGPADS = drill 1.016 long: 1 0,0; 2 2.54,-0.254; 3 5.08,0; 4 7.62,-0.254; 5 10.16,0
MOLEX-1X3_LOCK = drill 1.016 pad 1.88 square: 1 0,0.127 | drill 1.016 pad 1.88: 2 2.54,-0.127; 3 5.08,0.127
RTE44024F = drill 1.4: 11 9.06,-3.75; 12 4.01,-3.75; 14 14.11,-3.75; 21 9.06,3.7; 22 4.01,3.7; 24 14.11,3.7; A1 -11.29,-3.75; A2 -11.29,3.75
APF30212A = drill 1 pad 1.7: 1 -12.6,0; 2 -8.82,0 | drill 1.3 pad 1.9: COM 7.56,0; NO 12.6,0
RT424F24 = drill 1.4: 11 11.6,-3.75; 12 6.55,-3.75; 14 16.65,-3.75; 21 11.6,3.7; 22 6.55,3.7; 24 16.65,3.7; A1 -8.75,-3.75; A2 -8.75,3.75; A3 -8.75,0
ACM1513-551-2PL-TL = smd 1.25 x 0.95: IN+ -2.4,1; IN- -2.4,-1; OUT+ 2.4,1; OUT- 2.4,-1
CHIPLED_0805 = smd 1.2 x 1.2: A 0,-1.05; C 0,1.05
SO08 = smd 0.61 x 2.21: 1 -1.905,-2.616; 2 -0.635,-2.616; 3 0.635,-2.616; 4 1.905,-2.616; 5 1.905,2.616; 6 0.635,2.616; 7 -0.635,2.616; 8 -1.905,2.616
SOT23-3 = smd 0.8 x 0.9: 1 -0.95,-1; 2 0.95,-1; 3 0,1.1
SOT-23 = smd 0.8 x 0.9: 1 -0.95,-0.23; 2 0.95,-0.23; 3 0,1.87
R0805 = smd 1.1 x 1.4: 1 -1,0; 2 1,0
R6332 = smd 1.8 x 3.2: 1 -2.8,0; 2 2.8,0
STAND-OFF = hole 3.302: 0,0
TQFP-44 = smd 1.5 x 0.5: 1 -5.8,4; 2 -5.8,3.2; 3 -5.8,2.4; 4 -5.8,1.6; 5 -5.8,0.8; 6 -5.8,0; 7 -5.8,-0.8; 8 -5.8,-1.6; 9 -5.8,-2.4; 10 -5.8,-3.2; 11 -5.8,-4; 23 5.8,-4; 24 5.8,-3.2; 25 5.8,-2.4; 26 5.8,-1.6; 27 5.8,-0.8; 28 5.8,0; 29 5.8,0.8; 30 5.8,1.6; 31 5.8,2.4; 32 5.8,3.2; 33 5.8,4 | smd 0.5 x 1.5: 12 -4,-5.8; 13 -3.2,-5.8; 14 -2.4,-5.8; 15 -1.6,-5.8; 16 -0.8,-5.8; 17 0,-5.8; 18 0.8,-5.8; 19 1.6,-5.8; 20 2.4,-5.8; 21 3.2,-5.8; 22 4,-5.8; 34 4,5.8; 35 3.2,5.8; 36 2.4,5.8; 37 1.6,5.8; 38 0.8,5.8; 39 0,5.8; 40 -0.8,5.8; 41 -1.6,5.8; 42 -2.4,5.8; 43 -3.2,5.8; 44 -4,5.8
SO-8 = smd 0.61 x 2.21: 1 -1.905,-2.616; 2 -0.635,-2.616; 3 0.635,-2.616; 4 1.905,-2.616; 5 1.905,2.616; 6 0.635,2.616; 7 -0.635,2.616; 8 -1.905,2.616
SOT23-5 = smd 0.55 x 1.2: 1 -0.95,-1.3; 2 0,-1.3; 3 0.95,-1.3; 4 0.95,1.3; 5 -0.95,1.3
APXW005A0X43-SRZ = smd 1.73 x 2.44: 1 1.28,1.52 | smd 2.44 x 1.73: 2 18.796,1.27; 3 13.92,10.16; 4 9.906,10.16; 5 5.842,10.16; 6 1.574,10.16
TSSOP-8 = smd 1.2 x 0.35: 1 -2.925,0.975; 2 -2.925,0.325; 3 -2.925,-0.325; 4 -2.925,-0.975; 5 2.925,-0.975; 6 2.925,-0.325; 7 2.925,0.325; 8 2.925,0.975
CS64 = drill 1.016 pad 1.88: 1 -38.1,1.27; 2 -35.56,1.27; 3 -33.02,1.27; 4 -30.48,1.27; 5 -27.94,1.27; 6 -25.4,1.27; 7 -22.86,1.27; 8 -20.32,1.27; 9 -17.78,1.27; 10 -15.24,1.27; 11 -12.7,1.27; 12 -10.16,1.27; 13 -7.62,1.27; 14 -5.08,1.27; 15 -2.54,1.27; 16 0,1.27; 17 2.54,1.27; 18 5.08,1.27; 19 7.62,1.27; 20 10.16,1.27; 21 12.7,1.27; 22 15.24,1.27; 23 17.78,1.27; 24 20.32,1.27; 25 22.86,1.27; 26 25.4,1.27; 27 27.94,1.27; 28 30.48,1.27; 29 33.02,1.27; 30 35.56,1.27; 31 38.1,1.27; 32 40.64,1.27; 33 -38.1,-1.27; 34 -35.56,-1.27; 35 -33.02,-1.27; 36 -30.48,-1.27; 37 -27.94,-1.27; 38 -25.4,-1.27; 39 -22.86,-1.27; 40 -20.32,-1.27; 41 -17.78,-1.27; 42 -15.24,-1.27; 43 -12.7,-1.27; 44 -10.16,-1.27; 45 -7.62,-1.27; 46 -5.08,-1.27; 47 -2.54,-1.27; 48 0,-1.27; 49 2.54,-1.27; 50 5.08,-1.27; 51 7.62,-1.27; 52 10.16,-1.27; 53 12.7,-1.27; 54 15.24,-1.27; 55 17.78,-1.27; 56 20.32,-1.27; 57 22.86,-1.27; 58 25.4,-1.27; 59 27.94,-1.27; 60 30.48,-1.27; 61 33.02,-1.27; 62 35.56,-1.27; 63 38.1,-1.27; 64 40.64,-1.27 | hole 3.2: -50.8,-6.007; -50.8,6.007; 50.8,6.007; 50.8,-6.007
0603-RES = smd 1.1 x 1: 1 -0.85,0; 2 0.85,0

### Placement (x,y rotation side)
9V  147.65,62.26 90 top  (outside the outline)
12V  -15.19,53.92 180 top  (outside the outline)
C1  -5.33,50.04 90 top  (outside the outline)
C2  151.03,52.86 0 top  (outside the outline)
C3  64.87,78.41 270 bottom
C4  130.1,71.53 90 top  (outside the outline)
C5  2.54,55.5 180 top
C6  64.92,39.93 180 top
C7  -25.73,84.18 180 top  (outside the outline)
C8  130.1,79.25 90 top  (outside the outline)
C9  133.35,73.94 90 top  (outside the outline)
C10  198.88,124.82 180 top  (outside the outline)
C11  183.46,104.93 0 top  (outside the outline)
C15  69.52,31.98 270 bottom
C16  65.94,28.3 180 bottom
C17  64.92,51.46 180 top
C18  60.83,-5.23 270 top  (outside the outline)
C19  65.86,-5.26 270 top  (outside the outline)
C20  -30.51,32.03 0 top  (outside the outline)
C23  66.4,20.42 180 bottom
D1  29.29,32.77 90 bottom
D2  -25.15,34.87 180 top  (outside the outline)
D3  66.29,32.18 0 top
D5  31.6,49.81 90 bottom
D6  16.18,47.6 0 bottom
D7  26.85,49.81 90 bottom
D8  7.98,47.73 180 bottom
D9  66.5,28.55 0 top
F1  18.57,156.34 180 top
F2  18.29,132.64 180 top
F3  18.75,112.93 180 top
F4  18.64,152.53 180 top
F5  49.78,49.78 270 top
F6  49.76,35.94 270 top
F8  49.78,64.39 270 top
J1  25.2,9.5 0 top
J2  82.42,9.55 0 top
JP1  174.55,102.77 180 top  (outside the outline)
JP2  -34.32,114 0 top  (outside the outline)
K1  21.21,33.02 180 top
K4  -58.93,61.57 180 top  (outside the outline)
K5  -58.9,71.53 180 top  (outside the outline)
K7  29.21,53.09 90 top
K8  11.46,53.09 90 top
L1  66.52,22.68 90 top
LED1  173,116.46 180 top  (outside the outline)
LED2  168.73,116.89 180 top  (outside the outline)
LED3  194.31,122.07 0 top  (outside the outline)
LED4  -24.92,113.23 0 top  (outside the outline)
LED5  -20.93,113.23 0 top  (outside the outline)
LED6  194.31,126.36 180 top  (outside the outline)
LED7  97.1,50.5 270 top
LED8  96.85,63.42 270 top
LED9  96.67,88.98 270 top
LED10  96.09,75.18 270 top
LED11  50.16,22.17 0 top
LED12  96.37,37.29 270 top
LED13  -41.58,129.79 180 top  (outside the outline)
Q1  98.3,43.48 90 top
Q2  98.22,68.05 90 top
Q3  98.25,56.24 90 top
Q4  35.33,48.51 180 bottom
Q5  98.27,81.48 90 top
Q6  23.14,48.51 180 bottom
Q7  54.28,17.17 180 bottom
Q8  98.25,29.9 90 top
Q9  -43.94,135.15 90 top  (outside the outline)
Q10  25.32,30.3 90 bottom
Q12  15.75,51.89 180 bottom
Q13  6.65,51.79 270 bottom
QE1  99.85,60.71 270 top
QE2  99.95,72.54 270 top
QE3  99.87,85.93 270 top
QE4  59.74,23.47 270 bottom
QE5  99.95,47.9 270 top
QE6  99.77,34.42 270 top
QE7  -41.3,140.92 180 top  (outside the outline)
R1  -28.14,39.24 180 top  (outside the outline)
R2  173.41,99.31 180 top  (outside the outline)
R3  172.9,121.97 90 top  (outside the outline)
R4  168.5,121.97 90 top  (outside the outline)
R5  151.13,54.91 0 top  (outside the outline)
R6  147.88,55.91 270 top  (outside the outline)
R7  106.76,42.6 180 top
R8  -13.08,25.98 180 top  (outside the outline)
R9  -13.08,22.17 0 top  (outside the outline)
R10  31.93,79.4 90 top
R11  25.32,172.54 90 top
R12  27.05,170 180 top
R13  12.5,22.56 270 top
R14  14.3,32.69 90 bottom
R15  47.73,-6.53 0 top  (outside the outline)
R16  27.56,172.54 270 top
R17  35.31,172.47 90 top
R18  106.96,55.3 180 top
R19  106.68,66.62 180 top
R20  194.36,116.54 270 top  (outside the outline)
R21  106.76,80.7 180 top
R22  -14.48,62.33 90 top  (outside the outline)
R23  36.45,170.05 180 top
R24  61.77,77.5 0 bottom
R25  152.73,62.03 0 top  (outside the outline)
R26  64.87,83.39 270 bottom
R27  106.73,28.7 180 top
R28  -34.98,133.45 180 top  (outside the outline)
R29  13.82,55.5 180 bottom
R30  21.49,31.42 180 bottom
R31  36.42,52.7 270 bottom
R32  34.39,52.68 90 bottom
R33  21.44,29.29 0 bottom
R34  12.52,61.65 0 bottom
R35  23.95,52.65 270 bottom
R36  10.11,51.82 90 bottom
R37  11.28,57.18 0 bottom
R38  22.12,52.65 270 bottom
R39  129.62,85.01 90 top  (outside the outline)
R40  134.7,69.55 90 top  (outside the outline)
R44  72.69,23.98 270 bottom
R45  75.46,24.05 270 bottom
R46  -49.48,105.99 0 top  (outside the outline)
R47  -46.53,105.99 0 top  (outside the outline)
R48  37.72,172.47 270 top
R49  42.72,158.09 0 top
R50  49.05,157.4 180 top
R51  49.56,153.49 0 top
RPU1  104.47,58.39 0 top
RPU2  104.27,46.2 0 top
RPU3  104.06,69.93 0 top
RPU4  104.11,83.95 0 top
RPU5  98.07,60.78 90 top
RPU6  98.17,47.88 90 top
RPU7  98.04,72.57 90 top
RPU8  97.84,86 90 top
RPU9  95.68,47.93 270 top
RPU10  95.4,60.76 270 top
RPU11  95.61,86 270 top
RPU12  94.95,72.62 270 top
RPU13  55.09,23.14 0 bottom
RPU14  58.95,26.16 180 bottom
RPU15  50.22,16.36 270 bottom
RPU16  104.04,31.85 0 top
RPU17  97.89,34.37 90 top
RPU18  95.3,34.57 270 top
RPU19  -38.3,137.03 0 top  (outside the outline)
RPU20  -41.22,142.98 0 top  (outside the outline)
RPU21  -45.19,132.28 180 top  (outside the outline)
STANDOFF1  99.06,175.26 0 top
STANDOFF2  58.42,134.62 90 top
STANDOFF3  111.76,22.86 0 top
STANDOFF4  17.78,175.26 0 top
STANDOFF5  6.73,21.72 0 top
U1  21.69,84.81 0 top
U2  166.01,110.21 90 top  (outside the outline)
U3  63.42,60.71 270 top
U4  151.13,58.17 180 top  (outside the outline)
U5  108.05,47.35 180 top
U6  108.2,59.84 180 top
U7  108.43,71.07 180 top
U8  107.72,85.09 180 top
U9  70.43,86.87 270 top
U10  73.81,30.43 270 bottom
U12  57.61,86.84 270 top
U13  107.75,33.5 180 top
U14  -34.29,138.33 180 top  (outside the outline)
U$1  58.42,104.14 0 top
U$4  58.42,144.78 0 top
U$5  58.42,165.1 0 top
U$6  58.42,124.46 0 top
U$8  -4.8,12.4 0 top  (outside the outline)
V1  61.77,24.82 90 top
VIN  37.31,-5.61 90 top  (outside the outline)

### Tracks (layer width: path | path; a pad name or v marks a point on that pad's centre or on a via)
5V  (6 unrouted)
+5V  (10 unrouted)
+9V  (via drill 0.6)  (5 unrouted)
  Top 0.305: v65.08,85.95 67.08,85.95 U12.6
  Bottom 0.305: R26.1 64.87,85.75 v65.08,85.95
  pour Top: 108.18,79.4 108.2,84.07 114.05,84.07 114.05,26.42 107.95,26.42 107.87,32.38 108.43,32.94 111.51,32.94 111.84,33.27 111.84,51.99 110.9,52.93 109.22,52.93 108.33,53.82 108.33,59.03 108.81,59.51 111.15,59.51 111.71,60.07 111.71,64.29 111.33,64.67 108.61,64.67 108.38,64.9 108.38,70.33 108.79,70.74 111.02,70.74 111.35,71.07 111.35,77.06 110.82,77.6 108.56,77.6 108.15,78 108.15,79.38
+12V  (1 unrouted)
+24V  (19 unrouted)
  Bottom 0.406: 26.85,52.2 D7.C 28.18,52.21 29.21,51.18 | D5.C 31.6,52.2 30.23,52.2 29.21,51.18 | K7.A3 29.21,51.18
  Bottom 0.61: RPU13.2 52.86,23.14 52.83,23.11
  Bottom 1.016: Q7.3 Q7.2
  Bottom 1.422: Q7.2 54.08,19.79 54.1,19.81 52.83,19.81 | 52.83,19.81 52.4,19.81 Q7.1 | 52.83,19.81 52.83,23.11 52.83,24.26 58.29,29.84 58.29,60.58 57.15,62.23
AIR-BOT+PRE  (2 unrouted)
AIR-P
  Top 2.54: F8.2 41.66,64.39 39.75,62.48 39.75,40.26 35.94,36.45 35.94,20.95 39.12,17.78 39.12,13.58 J1.8
AIR-TOP  (2 unrouted)
ASEN-1  (1 unrouted)
  Top 0.406: U5.3 107.1,50.51 106.43,51.18 106.55,51.18 106.3,51.44
ASEN-2  (1 unrouted)
ASEN-3  (1 unrouted)
ASEN-4  (1 unrouted)
ASEN-5  (1 unrouted)
ASEN-6  (1 unrouted)
B-LIGHT
  Bottom 0.254: RPU15.2 50.22,15.19 50.8,14.61 52.32,14.61 Q7.8
  Bottom 1.422: Q7.8 Q7.7 Q7.6 Q7.5 56.52,14.22 56.52,12.06 59.03,9.55 J2.13
B-LIGHT-C  (2 unrouted)
BMM  (1 unrouted)
  Top 0.254: U$6.28 88.01,125.73 87.63,125.35 87.63,111.12 88.14,110.62 101.73,110.62 103.63,108.71
BMM-P  (1 unrouted)
  Top 1.27: J2.35 106.92,5.55 107.64,6.27 107.64,17.53 104.85,19.81 93.98,19.81 92.89,20.9 92.89,40.87 93.65,41.63 95.63,41.63 Q1.8
  Top 1.778: Q1.8 Q1.7 Q1.6 Q1.5
BOTS  (1 unrouted)
  Top 0.254: U$6.29 90.55,125.73 90.17,125.35 90.17,111.89 90.81,111.25 102.11,111.25 104.14,109.22
BOX-PWR  (8 unrouted)
BPD  (1 unrouted)
CSENSE  (1 unrouted)
DDS-P  (1 unrouted)
  Top 1.27: Q2.8 95.56,66.09 92.08,66.09 90.6,64.62 90.6,18.36 91.44,17.53 103.12,17.53 104.39,16.26 104.39,13.58 J2.12
  Top 1.778: Q2.8 Q2.7 Q2.6 Q2.5
ECU  (2 unrouted)
FAN
  Bottom 1.93: F5.2 41.27,49.78 40.13,48.64 40.13,23.75 43.81,20.07 43.81,12.32 41.02,9.53 37.22,9.53 J1.15
FROM-TSMS  (2 unrouted)
GND  (via drill 0.5, 0.6)  (36 unrouted)
  other vias: 103.61,172.29 6.78,80.54 53.98,41.25 46.81,23.9
  pour Bottom (rank 4): 0,0 116.84,0 116.84,180.34 0,180.34
  pour Top (rank 4): 0,0 116.84,0 116.84,180.34 0,180.34
H-EN  (1 unrouted)
H-SIG  (2 unrouted)
HORN+
  Bottom 0.254: J2.15 70.42,17.59 72.64,19.81 72.64,23.03 R44.2
HORN-
  Bottom 0.254: J2.16 74.42,16 75.44,17.02 75.44,23.13 R45.2
IMD  (2 unrouted)
IS  (1 unrouted)
  Top 0.254: U$6.24 79.5,125.73 80.01,125.22 80.01,109.86 81.28,108.58 100.71,108.58 101.73,107.57
LOOP-IN  (1 unrouted)
MAIN  (1 unrouted)
MCS-P  (via drill 0.6)  (2 unrouted)
  Top 1.27: v92.43,52.53 92.43,53.87 | 92.43,53.87 92.43,53.9 | 92.43,53.9 v92.41,53.92 | v92.41,55.24 92.41,53.9 92.43,53.87 | 92.43,53.9 92.43,55.27 92.76,55.6 Q3.7
  Top 1.778: Q3.8 Q3.7 Q3.6
  Bottom 1.27: J2.23 106.1,9.55 107.59,11.05 107.59,16.76 | 107.59,16.76 106.83,17.65 | v92.43,52.53 92.46,52.5 92.46,22.86 93.73,21.59 100.84,21.59 103.63,18.8 105.56,18.8 107.59,16.76 | v92.41,53.92 92.41,52.55 92.38,52.53 92.38,55.22 v92.41,55.24
N$1  (2 unrouted)
N$2  (5 unrouted)
N$3  (3 unrouted)
N$4  (1 unrouted)
N$5  (1 unrouted)
  Top 1.93: U$5.33 U$5.1 U$5.2 U$5.34
N$6
  Bottom 0.406: Q4.1 34.39,49.6 R32.1 34.42,51.8 R31.2
N$7  (1 unrouted)
N$8  (1 unrouted)
N$9
  Top 0.406: F2.1 20.07,132.64 20.07,130.3 20.19,130.3
  Top 1.93: U$6.33 U$6.1
  pour Top: 19.05,132.72 18.92,133.99 19.3,134.37 22.86,134.37 23.5,133.73 23.5,122.3 22.73,121.54 20.45,121.54 19.18,122.81 19.18,132.59
N$10  (5 unrouted)
N$11  (2 unrouted)
N$12  (3 unrouted)
  Top 1.93: U$1.33 U$1.1
N$13  (4 unrouted)
N$14  (5 unrouted)
N$15  (1 unrouted)
N$16  (1 unrouted)
N$17  (1 unrouted)
N$18  (2 unrouted)
N$19  (1 unrouted)
N$20  (1 unrouted)
N$21  (1 unrouted)
N$22  (1 unrouted)
N$23
  Bottom 0.406: Q6.1 22.12,49.51 R38.2 R35.2
N$24  (1 unrouted)
N$25  (1 unrouted)
N$26  (5 unrouted)
N$27  (2 unrouted)
N$28  (1 unrouted)
N$29  (1 unrouted)
N$30  (2 unrouted)
  pour Top (no thermals): 57.66,52.78 63.02,52.78 63.58,52.22 63.58,39.19 65.74,37.03 65.74,26.37 66.22,25.88 66.22,24.51 66.09,24.38 65.23,24.38 64.24,25.37 61.11,25.37 61.11,32.66 57.18,36.6 57.18,47.37 57.12,50.22 57.12,52.76
N$31  (2 unrouted)
N$32  (1 unrouted)
  Bottom 0.61: RPU13.1 55.99,23.13 56.13,22.99 56.13,19.84 Q7.4
N$33  (5 unrouted)
N$34  (via drill 0.6)
  Top 0.305: v50.16,19.18 LED11.A
  Bottom 0.305: RPU15.1 50.22,19.13 v50.16,19.18
N$35
  Bottom 0.305: C3.1 R26.2
N$36  (1 unrouted)
N$37  (via drill 0.6)
  Top 0.305: U12.4 66.19,76.94 65.68,76.43 65.66,76.43 v65.08,75.84
  Bottom 0.305: v65.08,75.84 65.08,77.31 C3.2 64.86,77.5 R24.1
N$38
  pour Top (no thermals): -42.37,131.39 -36.8,131.39 -36.47,131.72 -36.47,135.38 -36.12,135.74 -35.26,135.74 -34.75,136.25 -34.75,137.87 -34.9,138.02 -37.59,138.02 -37.87,137.74 -37.87,136.22 -38.23,135.86 -42.39,135.86 -42.57,135.69 -42.57,131.6
N$39
  Top 0.305: RPU19.1 -41.3,137.03 Q9.4 -41.33,139.02 QE7.3
N$40  (1 unrouted)
N$41
  Bottom 0.254: U$4.38 33.02,128.4 34.29,127.13 34.29,104.14 U$1.38
N$42  (1 unrouted)
N$43  (1 unrouted)
N$44  (1 unrouted)
N$45  (2 unrouted)
N$46  (2 unrouted)
N$47
  Bottom 0.406: K7.A1 32.96,44.38 31.6,45.74 D5.A 31.6,47.49 35.26,47.49 Q4.3
N$48  (2 unrouted)
N$49
  Bottom 0.406: K7.A2 25.46,44.38 26.85,45.77 D7.A 26.85,47.37 23.11,47.37 23.11,47.41 Q6.3
N$50  (2 unrouted)
N$51  (2 unrouted)
N$52
  Bottom 0.254: U10.8 72.72,27.5 72.52,27.3 72.52,25.05 R44.1
N$53
  Bottom 0.254: U10.5 75.37,27.5 75.56,27.3 75.56,25.05 R45.1
N$54  (1 unrouted)
N$55  (2 unrouted)
N$56
  Top 0.406: U1.23 31.52,80.81 R10.2
N$57
  Bottom 0.254: U$1.37 29.84,102.87 29.21,103.5 29.21,142.24 U$4.37
N$58  (2 unrouted)
N$59  (1 unrouted)
N$60  (2 unrouted)
N$71  (1 unrouted)
N$72  (1 unrouted)
P+F  (1 unrouted)
  Top 3.81: F6.2 42.29,35.94 40.13,33.78 40.13,25.4 44.83,20.7 44.83,6.99 43.31,5.46 39.23,5.46
PRE+  (1 unrouted)
RS1-A  (via drill 0.6)  (3 unrouted)
  Top 0.254: U$1.3 26.67,104.14 26.67,96.77 29.97,93.47 77.47,93.47 v79.76,91.19 | v81.03,21.08 81.03,18.14 v80.49,17.6 | v25.4,120.9 26.67,122.17 26.67,124.46 U$6.3 | 25.4,141.35 26.67,142.62 26.67,144.78 U$4.3 25.4,161.67 26.67,162.94 26.67,165.1 U$5.3
  Top 0.305: J2.6 80.42,17.53 v80.49,17.6
  Bottom 0.254: v79.76,91.19 80.26,90.68 80.26,21.84 v81.03,21.08 | U$1.3 v25.4,120.9
  Bottom 0.305: v80.49,17.6 95.12,17.6 96.39,16.33 96.39,13.58 J2.10
RS1-B  (via drill 0.6)  (2 unrouted)
  Top 0.254: U$1.4 28.45,105.41 29.21,104.65 29.21,95.76 30.48,94.49 79.5,94.49 v81.28,92.71 | v27.94,141.35 29.21,142.62 29.21,144.78 U$4.4 27.94,161.54 29.21,162.81 29.21,165.1 U$5.4 | v27.94,121.03 29.21,122.3 29.21,124.46 U$6.4
  Top 0.305: v84.43,19.71 J2.7
  Bottom 0.254: v81.28,92.71 81.28,22.86 v84.43,19.71 | U$6.4 v27.94,141.35 | U$1.4 v27.94,121.03
  Bottom 0.305: J2.11 100.42,19.19 99.92,19.68 84.45,19.68 v84.43,19.71
RS2-A  (1 unrouted)
  Top 0.254: U$4.7 35.56,161.54 36.83,162.81 36.83,165.1 U$5.7 35.55,166.38 R23.2 35.31,170.3 R17.1
  Bottom 0.254: J2.34 98.42,7.55 J2.22 98.42,16.64 96.72,18.34 81.41,18.34 79.35,20.4 79.35,88.75 76.99,91.11 42.49,91.11 35.94,97.66 35.94,100.97 36.83,101.85 36.83,104.14 U$1.7 35.56,121.03 36.83,122.3 36.83,124.46 U$6.7 35.56,141.22 36.83,142.49 36.83,144.78 U$4.7
RS2-B  (via drill 0.6)  (1 unrouted)
  Top 0.254: v35.31,96.39 37.21,96.39 v38.48,97.66 | U$4.8 38.1,161.67 39.37,162.94 39.37,165.1 U$5.8 37.35,167.12 R23.1 37.35,171.2 R48.2
  Bottom 0.254: J2.33 94.42,7.55 J2.21 94.37,15.74 93.65,16.26 79.35,16.26 78.56,17.04 78.56,88.34 76.63,90.27 42.14,90.27 37.72,94.69 37.72,94.74 36.07,96.39 v35.31,96.39 | v38.48,97.66 38.48,100.71 39.37,101.6 39.37,104.14 U$1.8 38.1,120.4 39.37,121.67 39.37,124.59 38.23,125.73 U$6.8 38.1,140.97 39.37,142.24 39.37,144.78 U$4.8
RS3-A  (2 unrouted)
  Bottom 0.254: U$1.35 25.4,103 24.13,104.27 24.13,142.24 U$4.35
RS3-B  (2 unrouted)
  Bottom 0.254: U$1.36 26.67,104.14 26.67,142.24 U$4.36
RX  (1 unrouted)
SAS-P
  Top 1.27: J2.8 88.42,76.23 91.69,79.5 95.58,79.5 Q5.8 | RPU11.2 95.66,85.05 Q5.5 Q5.6
  Top 1.778: Q5.6 Q5.7 Q5.8
SET  (1 unrouted)
SSW_C  (1 unrouted)
SSW_L  (1 unrouted)
  Top 0.254: U$6.26 84.45,125.73 85.09,125.09 85.09,111.25 86.36,109.98 101.35,109.98 102.87,108.46
  Bottom 0.406: J1.9 13.21,16.89
SSW_R  (1 unrouted)
SW1  (2 unrouted)
SW2  (2 unrouted)
SW3  (2 unrouted)
SW4  (2 unrouted)
SW5  (2 unrouted)
SW6  (2 unrouted)
TO-TSMS  (1 unrouted)
TSA  (via drill 0.6)
  Top 0.254: J2.25 64.42,3.4 65.79,2.03 79.48,2.03 80.37,2.92 80.37,5.49 J2.29 80.39,11.05 81.79,11.68 82.42,12.32 82.42,15.11 82.55,15.24 82.55,20.83 83.06,21.34 v83.06,23.37
  Bottom 0.254: U$4.11 45.72,145.97 46.99,144.7 46.99,139.09 48.54,137.54 103,137.54 104.9,135.64 104.9,100.97 104.39,100.46 85.6,100.46 82.8,97.66 82.8,23.62 v83.06,23.37
TSB  (via drill 0.6)
  Top 0.254: J2.26 68.42,4.22 69.72,2.92 77.47,2.92 v78.26,3.71 | v85.34,23.11 85.34,22.86 86.11,22.1 86.11,15.75 86.36,15.49 86.36,12.19 84.45,10.92 J2.30 84.58,5.71
  Bottom 0.254: v78.26,3.71 79.12,3.71 79.38,3.45 83.9,3.45 84.56,4.12 84.56,5.42 J2.30 | U$4.12 48.49,146.05 49.53,145.01 49.53,139.5 50.09,138.94 103.38,138.94 105.66,136.65 105.66,100.58 104.85,99.77 104.75,99.77 86,99.64 83.69,97.33 83.69,24.77 v85.34,23.11
TSS-P  (via drill 0.6)  (1 unrouted)
  Top 1.27: v99.44,25.55 97.79,25.55 v97.77,25.53 | v96.37,25.6 97.74,25.6 97.77,25.58 96.57,25.58 95.63,26.52 Q8.8 Q8.7 Q8.6 Q8.5
  Bottom 1.27: J2.27 72.47,5.51 72.47,2.9 73.05,2.31 87.71,2.31 88.42,3.03 J2.31 88.42,2.99 88.88,2.54 | 88.88,2.54 89.46,2.46 | v97.77,25.53 99.31,25.53 99.36,25.58 96.39,25.58 v96.37,25.6 | v99.44,25.55 99.92,25.55 104.39,21.08 106.43,21.08 109.73,17.78 109.73,4.32 107.95,2.54 88.88,2.54
TX  (1 unrouted)
U2-CNT  (2 unrouted)
VCCIO  (12 unrouted)
  Top 0.305: U14.5 -33.34,134.62 R28.1
VGND
  Bottom 1.422: C23.2 68.35,14.36 J2.3
  pour Top (no thermals): 67.01,20.12 67.03,20.78 67.01,21.49 72.24,21.46 74.09,19.61 74.09,13.34 73.2,11.94 67.92,11.94 66.93,13.67
VIN
  Top 3.81: 50.16,35.94 F6.1 50.29,35.94 50.16,36.07 | 50.16,35.94 50.16,36.07 | 50.16,36.07 50.16,49.91 | 50.16,49.91 50.16,64.39 F8.1 | F5.1 50.29,49.78 50.16,49.91 | 50.16,35.94 50.16,28.07 61.72,16.51
  Bottom 1.422: C23.1 64.45,14.26 J2.2
  pour Top (no thermals): 59.03,11.96 65.51,11.96 66.24,13.34 66.24,21.44 60.05,21.44 58.72,20.12 58.72,13.06
VSENSE  (2 unrouted)
VSENSE2  (1 unrouted)

### Text on the board
tPlace: IS | TM | SS | ECU